# EasyEDA Pro project NI接口485_测试板子_2.eprj

# Schematic Schematic1
Create Date: 2023-08-04; Page Name: 接转接板; Project Name: NI接口485_测试板子_2; Schematic Name: Schematic1; Update Date: 2023-08-17; Company: 嘉立创EDA; Page Size: A4; Version: V1.0
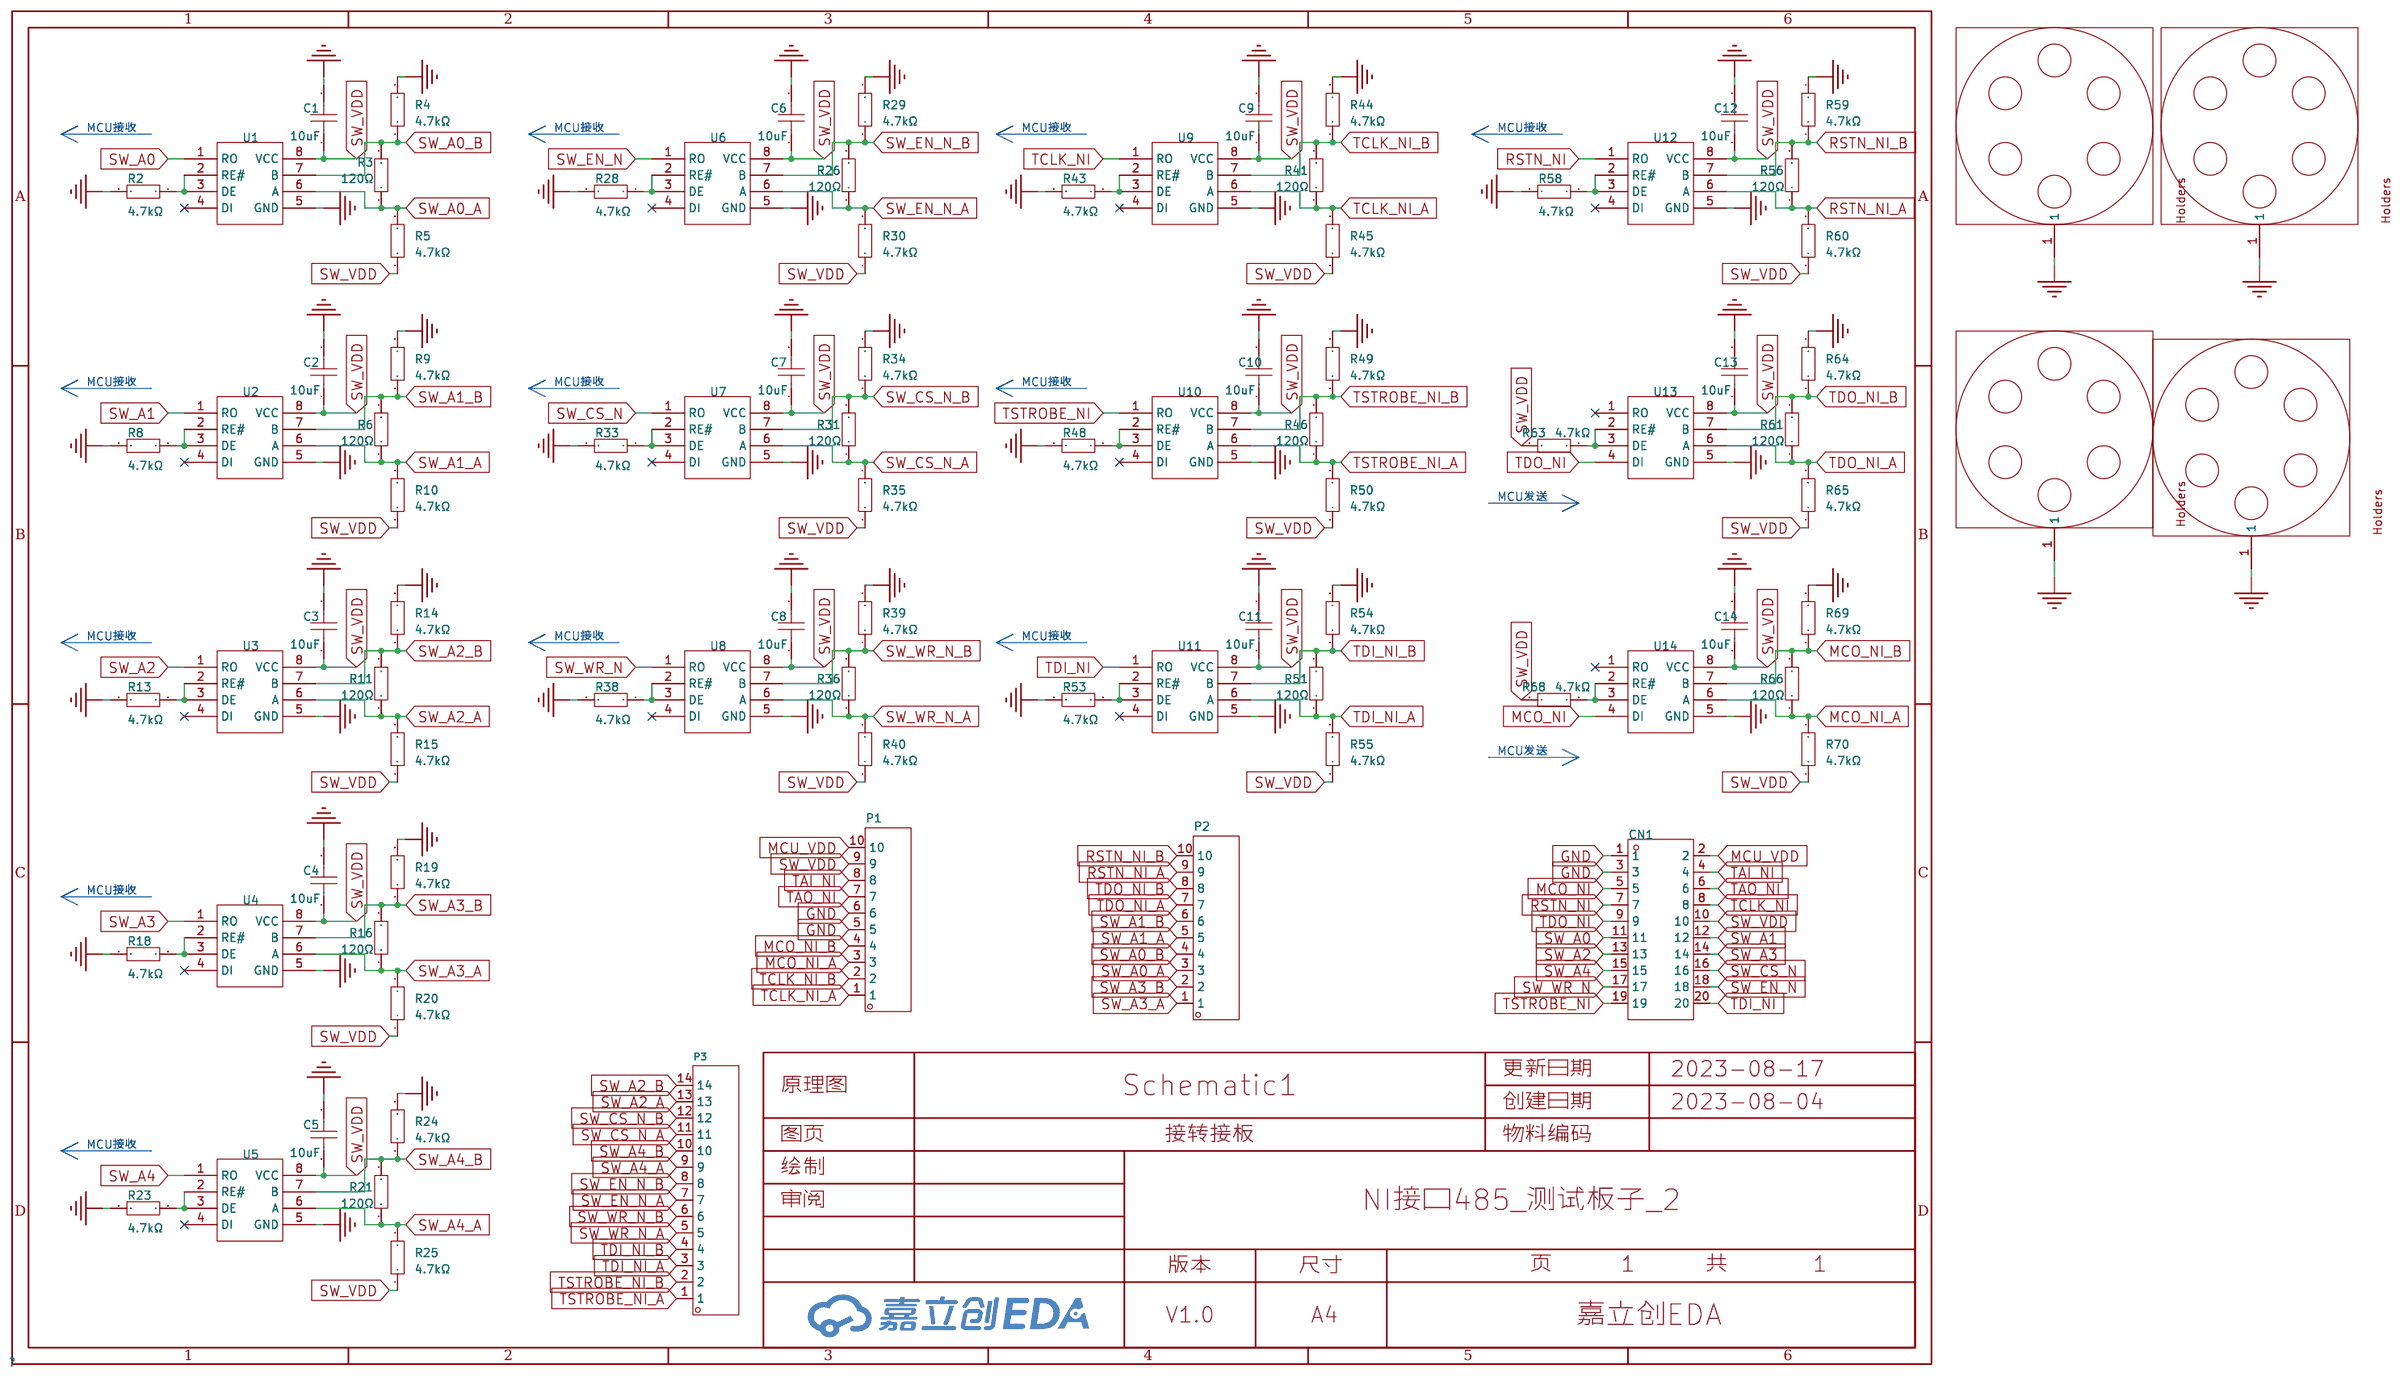
[diagram p0: schematic sheet]

## Parts
C1  10uF  [C0603]
C2  10uF  [C0603]
C3  10uF  [C0603]
C4  10uF  [C0603]
C5  10uF  [C0603]
C6  10uF  [C0603]
C7  10uF  [C0603]
C8  10uF  [C0603]
C9  10uF  [C0603]
C10  10uF  [C0603]
C11  10uF  [C0603]
C12  10uF  [C0603]
C13  10uF  [C0603]
C14  10uF  [C0603]
CN1  BH254V-20P  [CONN-TH_20P-P2.54_0702462001]
J1  -  [DEMO板安装孔]
J2  -  [DEMO板安装孔]
J3  -  [DEMO板安装孔]
J4  -  [DEMO板安装孔]
P1  WJ15EDGRC-3.81-10P  [CONN-TH_10P-P3.81_WJ15EDGRC-3.81-10P]
P2  WJ15EDGRC-3.81-10P  [CONN-TH_10P-P3.81_WJ15EDGRC-3.81-10P]
P3  WJ15EDGRC-3.81-14P  [CONN-TH_14P-P3.81_WJ15EDGRC-3.81-14P]
R2  4.7kΩ  [R0603]
R3  120Ω  [R0603]
R4  4.7kΩ  [R0603]
R5  4.7kΩ  [R0603]
R6  120Ω  [R0603]
R8  4.7kΩ  [R0603]
R9  4.7kΩ  [R0603]
R10  4.7kΩ  [R0603]
R11  120Ω  [R0603]
R13  4.7kΩ  [R0603]
R14  4.7kΩ  [R0603]
R15  4.7kΩ  [R0603]
R16  120Ω  [R0603]
R18  4.7kΩ  [R0603]
R19  4.7kΩ  [R0603]
R20  4.7kΩ  [R0603]
R21  120Ω  [R0603]
R23  4.7kΩ  [R0603]
R24  4.7kΩ  [R0603]
R25  4.7kΩ  [R0603]
R26  120Ω  [R0603]
R28  4.7kΩ  [R0603]
R29  4.7kΩ  [R0603]
R30  4.7kΩ  [R0603]
R31  120Ω  [R0603]
R33  4.7kΩ  [R0603]
R34  4.7kΩ  [R0603]
R35  4.7kΩ  [R0603]
R36  120Ω  [R0603]
R38  4.7kΩ  [R0603]
R39  4.7kΩ  [R0603]
R40  4.7kΩ  [R0603]
R41  120Ω  [R0603]
R43  4.7kΩ  [R0603]
R44  4.7kΩ  [R0603]
R45  4.7kΩ  [R0603]
R46  120Ω  [R0603]
R48  4.7kΩ  [R0603]
R49  4.7kΩ  [R0603]
R50  4.7kΩ  [R0603]
R51  120Ω  [R0603]
R53  4.7kΩ  [R0603]
R54  4.7kΩ  [R0603]
R55  4.7kΩ  [R0603]
R56  120Ω  [R0603]
R58  4.7kΩ  [R0603]
R59  4.7kΩ  [R0603]
R60  4.7kΩ  [R0603]
R61  120Ω  [R0603]
R63  4.7kΩ  [R0603]
R64  4.7kΩ  [R0603]
R65  4.7kΩ  [R0603]
R66  120Ω  [R0603]
R68  4.7kΩ  [R0603]
R69  4.7kΩ  [R0603]
R70  4.7kΩ  [R0603]
U1  SP485EEN-L/TR  [SOIC-8_L5.0-W4.0-P1.27-LS6.0-BL]
U2  SP485EEN-L/TR  [SOIC-8_L5.0-W4.0-P1.27-LS6.0-BL]
U3  SP485EEN-L/TR  [SOIC-8_L5.0-W4.0-P1.27-LS6.0-BL]
U4  SP485EEN-L/TR  [SOIC-8_L5.0-W4.0-P1.27-LS6.0-BL]
U5  SP485EEN-L/TR  [SOIC-8_L5.0-W4.0-P1.27-LS6.0-BL]
U6  SP485EEN-L/TR  [SOIC-8_L5.0-W4.0-P1.27-LS6.0-BL]
U7  SP485EEN-L/TR  [SOIC-8_L5.0-W4.0-P1.27-LS6.0-BL]
U8  SP485EEN-L/TR  [SOIC-8_L5.0-W4.0-P1.27-LS6.0-BL]
U9  SP485EEN-L/TR  [SOIC-8_L5.0-W4.0-P1.27-LS6.0-BL]
U10  SP485EEN-L/TR  [SOIC-8_L5.0-W4.0-P1.27-LS6.0-BL]
U11  SP485EEN-L/TR  [SOIC-8_L5.0-W4.0-P1.27-LS6.0-BL]
U12  SP485EEN-L/TR  [SOIC-8_L5.0-W4.0-P1.27-LS6.0-BL]
U13  SP485EEN-L/TR  [SOIC-8_L5.0-W4.0-P1.27-LS6.0-BL]
U14  SP485EEN-L/TR  [SOIC-8_L5.0-W4.0-P1.27-LS6.0-BL]

## Library data of the parts
C1-C14 = CL10A106KP8NNNC: 容值:10uF;精度:±10%;额定电压:10V;材质(温度系数):X5R;; LCSC Part Name: 10uF ±10% 10V; Supplier Part: C19702; Manufacturer: SAMSUNG(三星); Supplier Footprint: 0603; JLCPCB Part Class: Basic Part; Datasheet: https://atta.szlcsc.com/upload/public/pdf/source/20160103/1457707703378.pdf; Supplier: LCSC; Tolerance: ±10%; Voltage Rated: 10V; Temperature Coefficient: X5R
CN1 = BH254V-20P: 连接器类型:简牛座;每排PIN数:10;结构:2x10P;排数:2;间距:2.54mm;行距:2.54mm;封装形式:直插;额定电流:3A;额定电压:250V;工作温度范围:-40℃~+105℃;; LCSC Part Name: 每排P数:10 2x10P 排数:2 2.54mm; Supplier Part: C492444; Manufacturer: XFCN(兴飞); Supplier Footprint: 插件,P=2.54mm; JLCPCB Part Class: Extended Part; Datasheet: https://atta.szlcsc.com/upload/public/pdf/source/20200312/C492444_4AABE2FC4F6BE8226B85135616AF0092.pdf; Supplier: LCSC; Connector Type: 简牛座; Pin Number in each Row: 10; Structure: 2x10P; Number of Rows: 2; Pitch: 2.54mm; Row Spacing: 2.54mm; Holder Type: 直插; Current Rating (Max): 3A; Voltage Rating (Max): 250V; Operating Temperature Range: -40℃~+105℃
J1-J4 = 螺孔_3.1X6MM
P1 P2 = WJ15EDGRC-3.81-10P: 连接器类型:板端/插座-闭口;间距:3.81mm;排数:1;每排PIN数:10;安装方式:弯针;颜色:绿色;; LCSC Part Name: 板端/插座-闭口 3.81mm 排数:1 每排P数:10 弯针; Supplier Part: C26895; Manufacturer: KANGNEX(康奈克斯电气); Supplier Footprint: P=3.81mm; JLCPCB Part Class: Extended Part; Datasheet: https://atta.szlcsc.com/upload/public/pdf/source/20191225/C26895_4D916DB43CEF69A0001F97FDF773E4BF.pdf; Supplier: LCSC; Connector Type: 板端/插座-闭口; Pitch: 3.81mm; Number of Rows: 1; Number of PINs Per Row: 10; Mounting Style: 弯针; Color: 绿色
P3 = WJ15EDGRC-3.81-14P: 连接器类型:板端/插座-闭口;结构:1x14P;间距:3.81mm;排数:1;每排PIN数:14;安装方式:弯针;颜色:绿色;; LCSC Part Name: 板端/插座-闭口 1x14P 3.81mm 排数:1 每排P数:14 弯针; Supplier Part: C31933; Manufacturer: KANGNEX(康奈克斯电气); Supplier Footprint: 弯插,P=3.81mm; JLCPCB Part Class: Extended Part; Datasheet: https://atta.szlcsc.com/upload/public/pdf/source/20191225/C31933_D56DE114D60976BC410F77D80AC71242.pdf; Supplier: LCSC; Connector Type: 板端/插座-闭口; Structure: 1x14P; Pitch: 3.81mm; Number of Rows: 1; Number of PINs Per Row: 14; Mounting Style: 弯针; Color: 绿色
R2 R4 R5 R8-R10 R13-R15 R18-R20 R23-R25 R28-R30 R33-R35 R38-R40 R43-R45 R48-R50 R53-R55 R58-R60 R63-R65 R68-R70 = 0603WAF4701T5E: 电阻类型:厚膜电阻;阻值:4.7kΩ;精度:±1%;功率:100mW;; LCSC Part Name: 4.7kΩ ±1% 100mW; Supplier Part: C23162; Manufacturer: UNI-ROYAL(厚声); Supplier Footprint: 0603; JLCPCB Part Class: Basic Part; Datasheet: https://atta.szlcsc.com/upload/public/pdf/source/20200306/C422600_1E6D84923E4A46A82E41ADD87F860B5C.pdf; Supplier: LCSC; Type: 厚膜电阻; Tolerance: ±1%; Power(Watts): 100mW; Temperature Coefficient: ±100ppm/℃; Overload Voltage (Max): 75V; Operating Temperature Range: -55℃~+155℃
R3 R6 R11 R16 R21 R26 R31 R36 R41 R46 R51 R56 R61 R66 = 0603WAF1200T5E: 电阻类型:厚膜电阻;阻值:120Ω;精度:±1%;功率:100mW;; LCSC Part Name: 120Ω ±1% 100mW; Supplier Part: C22787; Manufacturer: UNI-ROYAL(厚声); Supplier Footprint: 0603; JLCPCB Part Class: Basic Part; Datasheet: https://atta.szlcsc.com/upload/public/pdf/source/20200306/C422600_1E6D84923E4A46A82E41ADD87F860B5C.pdf; Supplier: LCSC; Type: 厚膜电阻; Tolerance: ±1%; Power(Watts): 100mW; Temperature Coefficient: ±100ppm/℃; Overload Voltage (Max): 75V; Operating Temperature Range: -55℃~+155℃
U1-U14 = SP485EEN-L/TR: 类型:收发器;驱动器/接收器:1/1;数据速率:10Mbps;; LCSC Part Name: 5V供电 10Mbps 收发器; Supplier Part: C6855; Manufacturer: MaxLinear; Supplier Footprint: SOIC-8; JLCPCB Part Class: Basic Part; Datasheet: https://atta.szlcsc.com/upload/public/pdf/source/20210125/C916163_66C97B5ACCC910994E8B10780F9BD300.pdf; Supplier: LCSC; Types: 收发器; Driver/receiver: 1/1; Data Rate: 10Mbps; Supply Voltage: 4.75V~5.25V

## Nets
GND: C1.2 C2.2 C3.2 C4.2 C5.2 C6.2 C7.2 C8.2 C9.2 C10.2 C11.2 C12.2 C13.2 C14.2 CN1.1 CN1.3 J1.1 J2.1 J3.1 J4.1 P1.5 P1.6 R2.2 R4.2 R8.2 R9.2 R13.2 R14.2 R18.2 R19.2 R23.2 R24.2 R28.2 R29.2 R33.2 R34.2 R38.2 R39.2 R43.2 R44.2 R48.2 R49.2 R53.2 R54.2 R58.2 R59.2 R64.2 R69.2 U1.5(GND) U2.5(GND) U3.5(GND) U4.5(GND) U5.5(GND) U6.5(GND) U7.5(GND) U8.5(GND) U9.5(GND) U10.5(GND) U11.5(GND) U12.5(GND) U13.5(GND) U14.5(GND)
MCO_NI: CN1.5 U14.4(DI)
MCO_NI_A: P1.3 R66.1 R70.2 U14.6(A)
MCO_NI_B: P1.4 R66.2 R69.1 U14.7(B)
MCU_VDD: CN1.2 P1.10
RSTN_NI: CN1.7 U12.1(RO)
RSTN_NI_A: P2.9 R56.1 R60.2 U12.6(A)
RSTN_NI_B: P2.10 R56.2 R59.1 U12.7(B)
SW_A0: CN1.11 U1.1(RO)
SW_A0_A: P2.3 R3.1 R5.2 U1.6(A)
SW_A0_B: P2.4 R3.2 R4.1 U1.7(B)
SW_A1: CN1.12 U2.1(RO)
SW_A1_A: P2.5 R6.1 R10.2 U2.6(A)
SW_A1_B: P2.6 R6.2 R9.1 U2.7(B)
SW_A2: CN1.13 U3.1(RO)
SW_A2_A: P3.13 R11.1 R15.2 U3.6(A)
SW_A2_B: P3.14 R11.2 R14.1 U3.7(B)
SW_A3: CN1.14 U4.1(RO)
SW_A3_A: P2.1 R16.1 R20.2 U4.6(A)
SW_A3_B: P2.2 R16.2 R19.1 U4.7(B)
SW_A4: CN1.15 U5.1(RO)
SW_A4_A: P3.9 R21.1 R25.2 U5.6(A)
SW_A4_B: P3.10 R21.2 R24.1 U5.7(B)
SW_CS_N: CN1.16 U7.1(RO)
SW_CS_N_A: P3.11 R31.1 R35.2 U7.6(A)
SW_CS_N_B: P3.12 R31.2 R34.1 U7.7(B)
SW_EN_N: CN1.18 U6.1(RO)
SW_EN_N_A: P3.7 R26.1 R30.2 U6.6(A)
SW_EN_N_B: P3.8 R26.2 R29.1 U6.7(B)
SW_VDD: C1.1 C2.1 C3.1 C4.1 C5.1 C6.1 C7.1 C8.1 C9.1 C10.1 C11.1 C12.1 C13.1 C14.1 CN1.10 P1.9 R5.1 R10.1 R15.1 R20.1 R25.1 R30.1 R35.1 R40.1 R45.1 R50.1 R55.1 R60.1 R63.2 R65.1 R68.2 R70.1 U1.8(VCC) U2.8(VCC) U3.8(VCC) U4.8(VCC) U5.8(VCC) U6.8(VCC) U7.8(VCC) U8.8(VCC) U9.8(VCC) U10.8(VCC) U11.8(VCC) U12.8(VCC) U13.8(VCC) U14.8(VCC)
SW_WR_N: CN1.17 U8.1(RO)
SW_WR_N_A: P3.5 R36.1 R40.2 U8.6(A)
SW_WR_N_B: P3.6 R36.2 R39.1 U8.7(B)
TAI_NI: CN1.4 P1.8
TAO_NI: CN1.6 P1.7
TCLK_NI: CN1.8 U9.1(RO)
TCLK_NI_A: P1.1 R41.1 R45.2 U9.6(A)
TCLK_NI_B: P1.2 R41.2 R44.1 U9.7(B)
TDI_NI: CN1.20 U11.1(RO)
TDI_NI_A: P3.3 R51.1 R55.2 U11.6(A)
TDI_NI_B: P3.4 R51.2 R54.1 U11.7(B)
TDO_NI: CN1.9 U13.4(DI)
TDO_NI_A: P2.7 R61.1 R65.2 U13.6(A)
TDO_NI_B: P2.8 R61.2 R64.1 U13.7(B)
TSTROBE_NI: CN1.19 U10.1(RO)
TSTROBE_NI_A: P3.1 R46.1 R50.2 U10.6(A)
TSTROBE_NI_B: P3.2 R46.2 R49.1 U10.7(B)
$1N832: R2.1 U1.2(RE#) U1.3(DE)
$1N23092: R8.1 U2.2(RE#) U2.3(DE)
$1N23454: R13.1 U3.2(RE#) U3.3(DE)
$1N23823: R18.1 U4.2(RE#) U4.3(DE)
$1N24177: R23.1 U5.2(RE#) U5.3(DE)
$1N24547: R28.1 U6.2(RE#) U6.3(DE)
$1N24901: R33.1 U7.2(RE#) U7.3(DE)
$1N25255: R38.1 U8.2(RE#) U8.3(DE)
$1N26283: R43.1 U9.2(RE#) U9.3(DE)
$1N26304: R48.1 U10.2(RE#) U10.3(DE)
$1N26325: R53.1 U11.2(RE#) U11.3(DE)
$1N27345: R58.1 U12.2(RE#) U12.3(DE)
$1N27366: R63.1 U13.2(RE#) U13.3(DE)
$1N27387: R68.1 U14.2(RE#) U14.3(DE)

Not connected (* = marked no-connect by the designer): U1 4(DI)*; U2 4(DI)*; U3 4(DI)*; U4 4(DI)*; U5 4(DI)*; U6 4(DI)*; U7 4(DI)*; U8 4(DI)*; U9 4(DI)*; U10 4(DI)*; U11 4(DI)*; U12 4(DI)*; U13 1(RO)*; U14 1(RO)*

## Notes on the sheet
- MCU接收
- MCU接收
- MCU接收
- MCU接收
- MCU接收
- MCU接收
- MCU接收
- MCU发送
- MCU接收
- MCU接收
- MCU接收
- MCU发送
- MCU接收
- MCU接收

# Schematic Schematic2
Create Date: 2023-08-04; Page Name: 接NI; Project Name: NI接口485_测试板子_2; Schematic Name: Schematic2; Update Date: 2023-08-21; Company: 嘉立创EDA; Page Size: A4; Version: V1.0
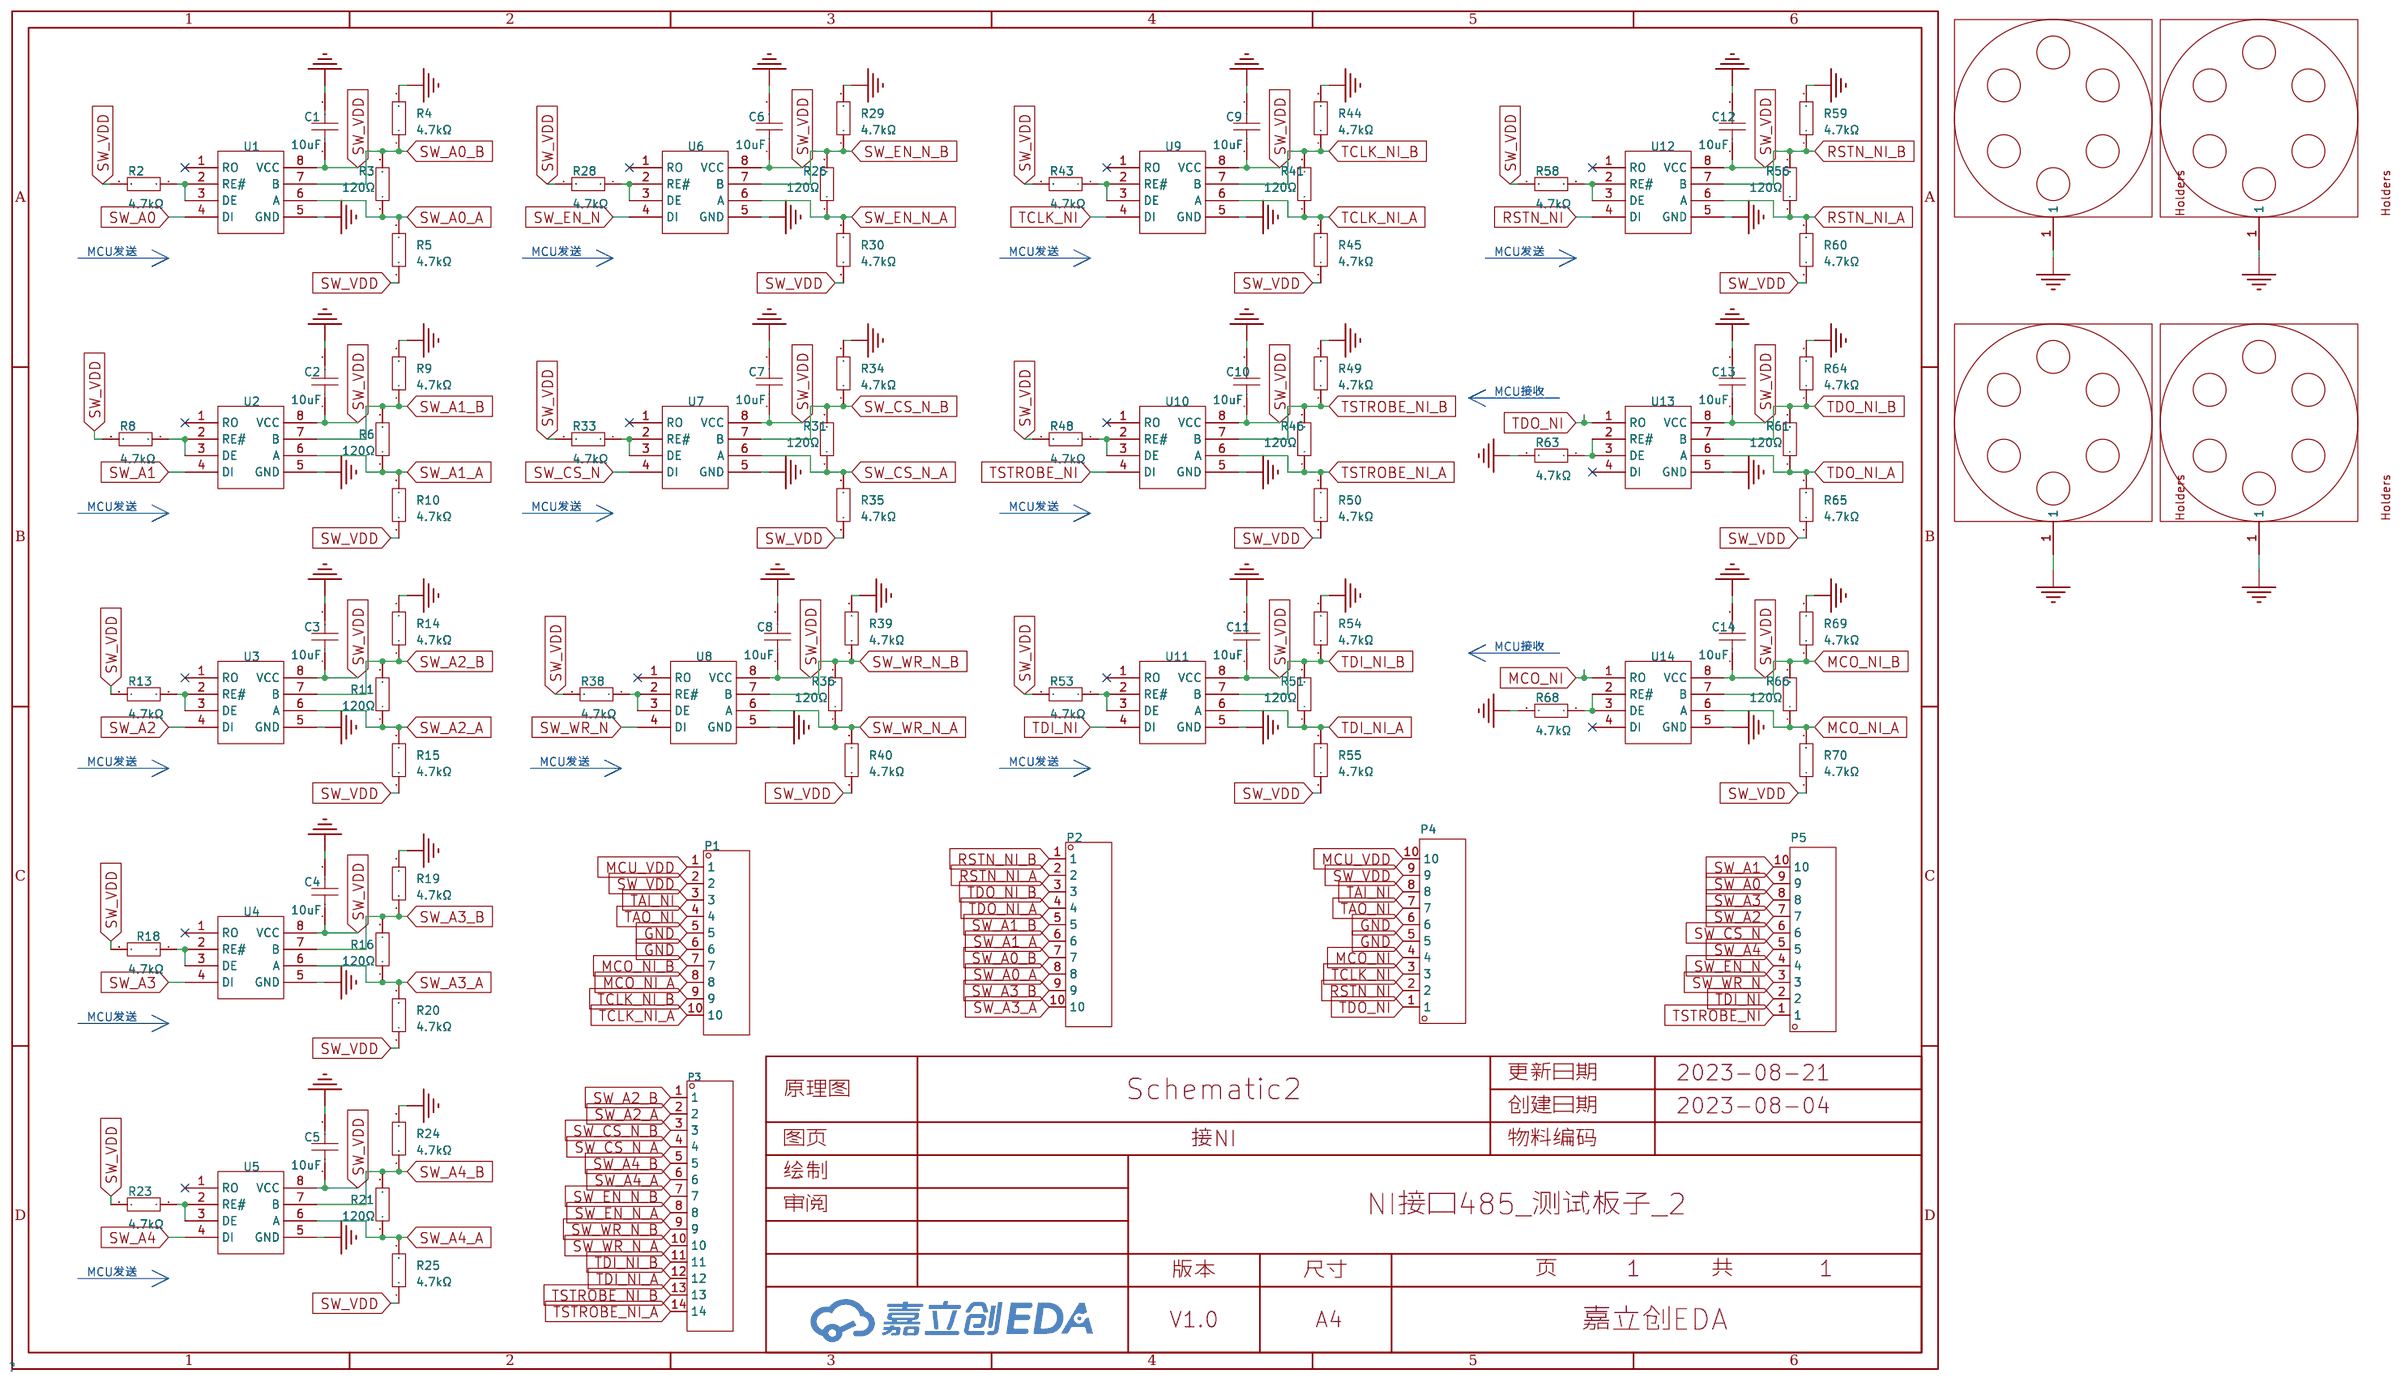
[diagram p1: schematic sheet]

## Parts
C1  10uF  [C0603]
C2  10uF  [C0603]
C3  10uF  [C0603]
C4  10uF  [C0603]
C5  10uF  [C0603]
C6  10uF  [C0603]
C7  10uF  [C0603]
C8  10uF  [C0603]
C9  10uF  [C0603]
C10  10uF  [C0603]
C11  10uF  [C0603]
C12  10uF  [C0603]
C13  10uF  [C0603]
C14  10uF  [C0603]
J1  -  [DEMO板安装孔]
J2  -  [DEMO板安装孔]
J3  -  [DEMO板安装孔]
J4  -  [DEMO板安装孔]
P1  WJ15EDGRC-3.81-10P  [CONN-TH_10P-P3.81_WJ15EDGRC-3.81-10P]
P2  WJ15EDGRC-3.81-10P  [CONN-TH_10P-P3.81_WJ15EDGRC-3.81-10P]
P3  WJ15EDGRC-3.81-14P  [CONN-TH_14P-P3.81_WJ15EDGRC-3.81-14P]
P4  WJ15EDGRC-3.81-10P  [CONN-TH_10P-P3.81_WJ15EDGRC-3.81-10P]
P5  WJ15EDGRC-3.81-10P  [CONN-TH_10P-P3.81_WJ15EDGRC-3.81-10P]
R2  4.7kΩ  [R0603]
R3  120Ω  [R0603]
R4  4.7kΩ  [R0603]
R5  4.7kΩ  [R0603]
R6  120Ω  [R0603]
R8  4.7kΩ  [R0603]
R9  4.7kΩ  [R0603]
R10  4.7kΩ  [R0603]
R11  120Ω  [R0603]
R13  4.7kΩ  [R0603]
R14  4.7kΩ  [R0603]
R15  4.7kΩ  [R0603]
R16  120Ω  [R0603]
R18  4.7kΩ  [R0603]
R19  4.7kΩ  [R0603]
R20  4.7kΩ  [R0603]
R21  120Ω  [R0603]
R23  4.7kΩ  [R0603]
R24  4.7kΩ  [R0603]
R25  4.7kΩ  [R0603]
R26  120Ω  [R0603]
R28  4.7kΩ  [R0603]
R29  4.7kΩ  [R0603]
R30  4.7kΩ  [R0603]
R31  120Ω  [R0603]
R33  4.7kΩ  [R0603]
R34  4.7kΩ  [R0603]
R35  4.7kΩ  [R0603]
R36  120Ω  [R0603]
R38  4.7kΩ  [R0603]
R39  4.7kΩ  [R0603]
R40  4.7kΩ  [R0603]
R41  120Ω  [R0603]
R43  4.7kΩ  [R0603]
R44  4.7kΩ  [R0603]
R45  4.7kΩ  [R0603]
R46  120Ω  [R0603]
R48  4.7kΩ  [R0603]
R49  4.7kΩ  [R0603]
R50  4.7kΩ  [R0603]
R51  120Ω  [R0603]
R53  4.7kΩ  [R0603]
R54  4.7kΩ  [R0603]
R55  4.7kΩ  [R0603]
R56  120Ω  [R0603]
R58  4.7kΩ  [R0603]
R59  4.7kΩ  [R0603]
R60  4.7kΩ  [R0603]
R61  120Ω  [R0603]
R63  4.7kΩ  [R0603]
R64  4.7kΩ  [R0603]
R65  4.7kΩ  [R0603]
R66  120Ω  [R0603]
R68  4.7kΩ  [R0603]
R69  4.7kΩ  [R0603]
R70  4.7kΩ  [R0603]
U1  SP485EEN-L/TR  [SOIC-8_L5.0-W4.0-P1.27-LS6.0-BL]
U2  SP485EEN-L/TR  [SOIC-8_L5.0-W4.0-P1.27-LS6.0-BL]
U3  SP485EEN-L/TR  [SOIC-8_L5.0-W4.0-P1.27-LS6.0-BL]
U4  SP485EEN-L/TR  [SOIC-8_L5.0-W4.0-P1.27-LS6.0-BL]
U5  SP485EEN-L/TR  [SOIC-8_L5.0-W4.0-P1.27-LS6.0-BL]
U6  SP485EEN-L/TR  [SOIC-8_L5.0-W4.0-P1.27-LS6.0-BL]
U7  SP485EEN-L/TR  [SOIC-8_L5.0-W4.0-P1.27-LS6.0-BL]
U8  SP485EEN-L/TR  [SOIC-8_L5.0-W4.0-P1.27-LS6.0-BL]
U9  SP485EEN-L/TR  [SOIC-8_L5.0-W4.0-P1.27-LS6.0-BL]
U10  SP485EEN-L/TR  [SOIC-8_L5.0-W4.0-P1.27-LS6.0-BL]
U11  SP485EEN-L/TR  [SOIC-8_L5.0-W4.0-P1.27-LS6.0-BL]
U12  SP485EEN-L/TR  [SOIC-8_L5.0-W4.0-P1.27-LS6.0-BL]
U13  SP485EEN-L/TR  [SOIC-8_L5.0-W4.0-P1.27-LS6.0-BL]
U14  SP485EEN-L/TR  [SOIC-8_L5.0-W4.0-P1.27-LS6.0-BL]

## Library data of the parts
C1-C14 = CL10A106KP8NNNC: 容值:10uF;精度:±10%;额定电压:10V;材质(温度系数):X5R;; LCSC Part Name: 10uF ±10% 10V; Supplier Part: C19702; Manufacturer: SAMSUNG(三星); Supplier Footprint: 0603; JLCPCB Part Class: Basic Part; Datasheet: https://atta.szlcsc.com/upload/public/pdf/source/20160103/1457707703378.pdf; Supplier: LCSC; Tolerance: ±10%; Voltage Rated: 10V; Temperature Coefficient: X5R
J1-J4 = 螺孔_3.1X6MM
P1 P2 P4 P5 = WJ15EDGRC-3.81-10P: 连接器类型:板端/插座-闭口;间距:3.81mm;排数:1;每排PIN数:10;安装方式:弯针;颜色:绿色;; LCSC Part Name: 板端/插座-闭口 3.81mm 排数:1 每排P数:10 弯针; Supplier Part: C26895; Manufacturer: KANGNEX(康奈克斯电气); Supplier Footprint: P=3.81mm; JLCPCB Part Class: Extended Part; Datasheet: https://atta.szlcsc.com/upload/public/pdf/source/20191225/C26895_4D916DB43CEF69A0001F97FDF773E4BF.pdf; Supplier: LCSC; Connector Type: 板端/插座-闭口; Pitch: 3.81mm; Number of Rows: 1; Number of PINs Per Row: 10; Mounting Style: 弯针; Color: 绿色
P3 = WJ15EDGRC-3.81-14P: 连接器类型:板端/插座-闭口;结构:1x14P;间距:3.81mm;排数:1;每排PIN数:14;安装方式:弯针;颜色:绿色;; LCSC Part Name: 板端/插座-闭口 1x14P 3.81mm 排数:1 每排P数:14 弯针; Supplier Part: C31933; Manufacturer: KANGNEX(康奈克斯电气); Supplier Footprint: 弯插,P=3.81mm; JLCPCB Part Class: Extended Part; Datasheet: https://atta.szlcsc.com/upload/public/pdf/source/20191225/C31933_D56DE114D60976BC410F77D80AC71242.pdf; Supplier: LCSC; Connector Type: 板端/插座-闭口; Structure: 1x14P; Pitch: 3.81mm; Number of Rows: 1; Number of PINs Per Row: 14; Mounting Style: 弯针; Color: 绿色
R2 R4 R5 R8-R10 R13-R15 R18-R20 R23-R25 R28-R30 R33-R35 R38-R40 R43-R45 R48-R50 R53-R55 R58-R60 R63-R65 R68-R70 = 0603WAF4701T5E: 电阻类型:厚膜电阻;阻值:4.7kΩ;精度:±1%;功率:100mW;; LCSC Part Name: 4.7kΩ ±1% 100mW; Supplier Part: C23162; Manufacturer: UNI-ROYAL(厚声); Supplier Footprint: 0603; JLCPCB Part Class: Basic Part; Datasheet: https://atta.szlcsc.com/upload/public/pdf/source/20200306/C422600_1E6D84923E4A46A82E41ADD87F860B5C.pdf; Supplier: LCSC; Type: 厚膜电阻; Tolerance: ±1%; Power(Watts): 100mW; Temperature Coefficient: ±100ppm/℃; Overload Voltage (Max): 75V; Operating Temperature Range: -55℃~+155℃
R3 R6 R11 R16 R21 R26 R31 R36 R41 R46 R51 R56 R61 R66 = 0603WAF1200T5E: 电阻类型:厚膜电阻;阻值:120Ω;精度:±1%;功率:100mW;; LCSC Part Name: 120Ω ±1% 100mW; Supplier Part: C22787; Manufacturer: UNI-ROYAL(厚声); Supplier Footprint: 0603; JLCPCB Part Class: Basic Part; Datasheet: https://atta.szlcsc.com/upload/public/pdf/source/20200306/C422600_1E6D84923E4A46A82E41ADD87F860B5C.pdf; Supplier: LCSC; Type: 厚膜电阻; Tolerance: ±1%; Power(Watts): 100mW; Temperature Coefficient: ±100ppm/℃; Overload Voltage (Max): 75V; Operating Temperature Range: -55℃~+155℃
U1-U14 = SP485EEN-L/TR: 类型:收发器;驱动器/接收器:1/1;数据速率:10Mbps;; LCSC Part Name: 5V供电 10Mbps 收发器; Supplier Part: C6855; Manufacturer: MaxLinear; Supplier Footprint: SOIC-8; JLCPCB Part Class: Basic Part; Datasheet: https://atta.szlcsc.com/upload/public/pdf/source/20210125/C916163_66C97B5ACCC910994E8B10780F9BD300.pdf; Supplier: LCSC; Types: 收发器; Driver/receiver: 1/1; Data Rate: 10Mbps; Supply Voltage: 4.75V~5.25V

## Nets
GND: C1.2 C2.2 C3.2 C4.2 C5.2 C6.2 C7.2 C8.2 C9.2 C10.2 C11.2 C12.2 C13.2 C14.2 J1.1 J2.1 J3.1 J4.1 P1.5 P1.6 P4.5 P4.6 R4.2 R9.2 R14.2 R19.2 R24.2 R29.2 R34.2 R39.2 R44.2 R49.2 R54.2 R59.2 R63.2 R64.2 R68.2 R69.2 U1.5(GND) U2.5(GND) U3.5(GND) U4.5(GND) U5.5(GND) U6.5(GND) U7.5(GND) U8.5(GND) U9.5(GND) U10.5(GND) U11.5(GND) U12.5(GND) U13.5(GND) U14.5(GND)
MCO_NI: P4.4 U14.1(RO)
MCO_NI_A: P1.8 R66.1 R70.2 U14.6(A)
MCO_NI_B: P1.7 R66.2 R69.1 U14.7(B)
MCU_VDD: P1.1 P4.10
RSTN_NI: P4.2 U12.4(DI)
RSTN_NI_A: P2.2 R56.1 R60.2 U12.6(A)
RSTN_NI_B: P2.1 R56.2 R59.1 U12.7(B)
SW_A0: P5.9 U1.4(DI)
SW_A0_A: P2.8 R3.1 R5.2 U1.6(A)
SW_A0_B: P2.7 R3.2 R4.1 U1.7(B)
SW_A1: P5.10 U2.4(DI)
SW_A1_A: P2.6 R6.1 R10.2 U2.6(A)
SW_A1_B: P2.5 R6.2 R9.1 U2.7(B)
SW_A2: P5.7 U3.4(DI)
SW_A2_A: P3.2 R11.1 R15.2 U3.6(A)
SW_A2_B: P3.1 R11.2 R14.1 U3.7(B)
SW_A3: P5.8 U4.4(DI)
SW_A3_A: P2.10 R16.1 R20.2 U4.6(A)
SW_A3_B: P2.9 R16.2 R19.1 U4.7(B)
SW_A4: P5.5 U5.4(DI)
SW_A4_A: P3.6 R21.1 R25.2 U5.6(A)
SW_A4_B: P3.5 R21.2 R24.1 U5.7(B)
SW_CS_N: P5.6 U7.4(DI)
SW_CS_N_A: P3.4 R31.1 R35.2 U7.6(A)
SW_CS_N_B: P3.3 R31.2 R34.1 U7.7(B)
SW_EN_N: P5.4 U6.4(DI)
SW_EN_N_A: P3.8 R26.1 R30.2 U6.6(A)
SW_EN_N_B: P3.7 R26.2 R29.1 U6.7(B)
SW_VDD: C1.1 C2.1 C3.1 C4.1 C5.1 C6.1 C7.1 C8.1 C9.1 C10.1 C11.1 C12.1 C13.1 C14.1 P1.2 P4.9 R2.2 R5.1 R8.2 R10.1 R13.2 R15.1 R18.2 R20.1 R23.2 R25.1 R28.2 R30.1 R33.2 R35.1 R38.2 R40.1 R43.2 R45.1 R48.2 R50.1 R53.2 R55.1 R58.2 R60.1 R65.1 R70.1 U1.8(VCC) U2.8(VCC) U3.8(VCC) U4.8(VCC) U5.8(VCC) U6.8(VCC) U7.8(VCC) U8.8(VCC) U9.8(VCC) U10.8(VCC) U11.8(VCC) U12.8(VCC) U13.8(VCC) U14.8(VCC)
SW_WR_N: P5.3 U8.4(DI)
SW_WR_N_A: P3.10 R36.1 R40.2 U8.6(A)
SW_WR_N_B: P3.9 R36.2 R39.1 U8.7(B)
TAI_NI: P1.3 P4.8
TAO_NI: P1.4 P4.7
TCLK_NI: P4.3 U9.4(DI)
TCLK_NI_A: P1.10 R41.1 R45.2 U9.6(A)
TCLK_NI_B: P1.9 R41.2 R44.1 U9.7(B)
TDI_NI: P5.2 U11.4(DI)
TDI_NI_A: P3.12 R51.1 R55.2 U11.6(A)
TDI_NI_B: P3.11 R51.2 R54.1 U11.7(B)
TDO_NI: P4.1 U13.1(RO)
TDO_NI_A: P2.4 R61.1 R65.2 U13.6(A)
TDO_NI_B: P2.3 R61.2 R64.1 U13.7(B)
TSTROBE_NI: P5.1 U10.4(DI)
TSTROBE_NI_A: P3.14 R46.1 R50.2 U10.6(A)
TSTROBE_NI_B: P3.13 R46.2 R49.1 U10.7(B)
$1N33003: R2.1 U1.2(RE#) U1.3(DE)
$1N33046: R8.1 U2.2(RE#) U2.3(DE)
$1N33127: R13.1 U3.2(RE#) U3.3(DE)
$1N33159: R18.1 U4.2(RE#) U4.3(DE)
$1N33197: R23.1 U5.2(RE#) U5.3(DE)
$1N33551: R28.1 U6.2(RE#) U6.3(DE)
$1N33913: R33.1 U7.2(RE#) U7.3(DE)
$1N34275: R38.1 U8.2(RE#) U8.3(DE)
$1N34989: R43.1 U9.2(RE#) U9.3(DE)
$1N35351: R48.1 U10.2(RE#) U10.3(DE)
$1N35713: R53.1 U11.2(RE#) U11.3(DE)
$1N36075: R58.1 U12.2(RE#) U12.3(DE)
$1N36432: R63.1 U13.2(RE#) U13.3(DE)
$1N36797: R68.1 U14.2(RE#) U14.3(DE)

Not connected (* = marked no-connect by the designer): U1 1(RO)*; U2 1(RO)*; U3 1(RO)*; U4 1(RO)*; U5 1(RO)*; U6 1(RO)*; U7 1(RO)*; U8 1(RO)*; U9 1(RO)*; U10 1(RO)*; U11 1(RO)*; U12 1(RO)*; U13 4(DI)*; U14 4(DI)*

## Notes on the sheet
- MCU发送
- MCU发送
- MCU发送
- MCU发送
- MCU接收
- MCU发送
- MCU发送
- MCU发送
- MCU接收
- MCU发送
- MCU发送
- MCU发送
- MCU发送
- MCU发送

# Board PCB1
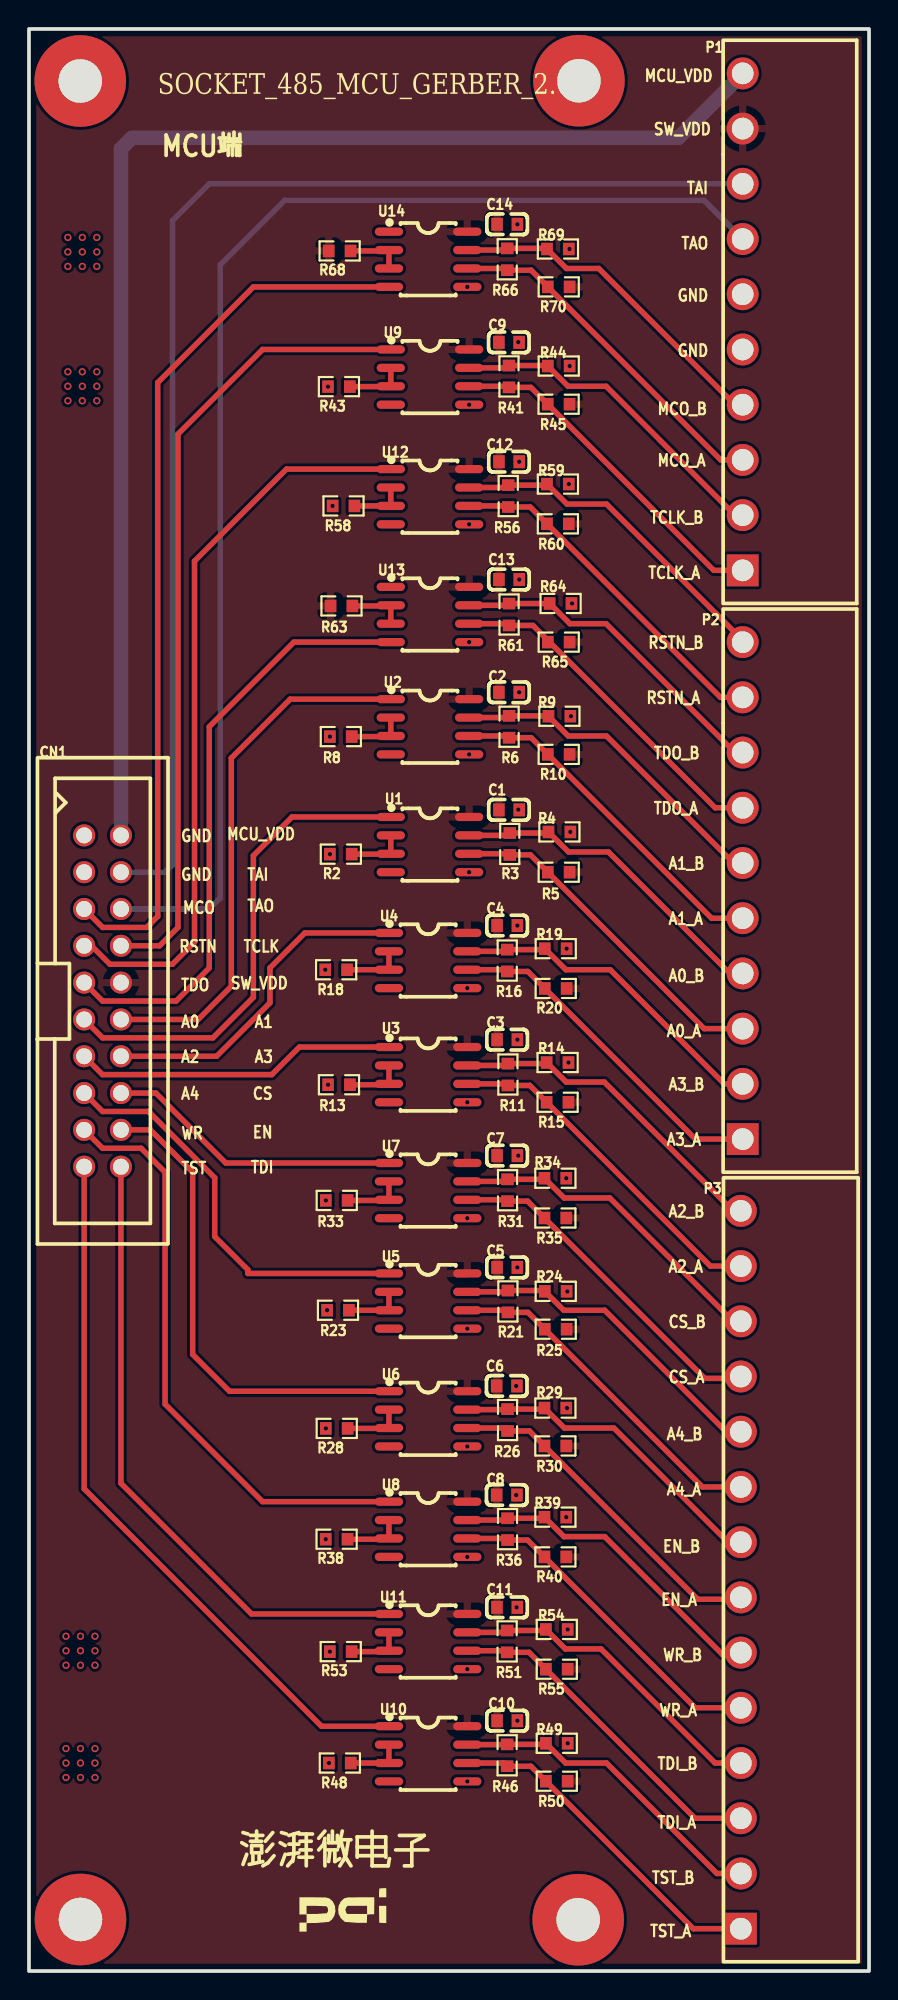
[diagram p2: board, top side]
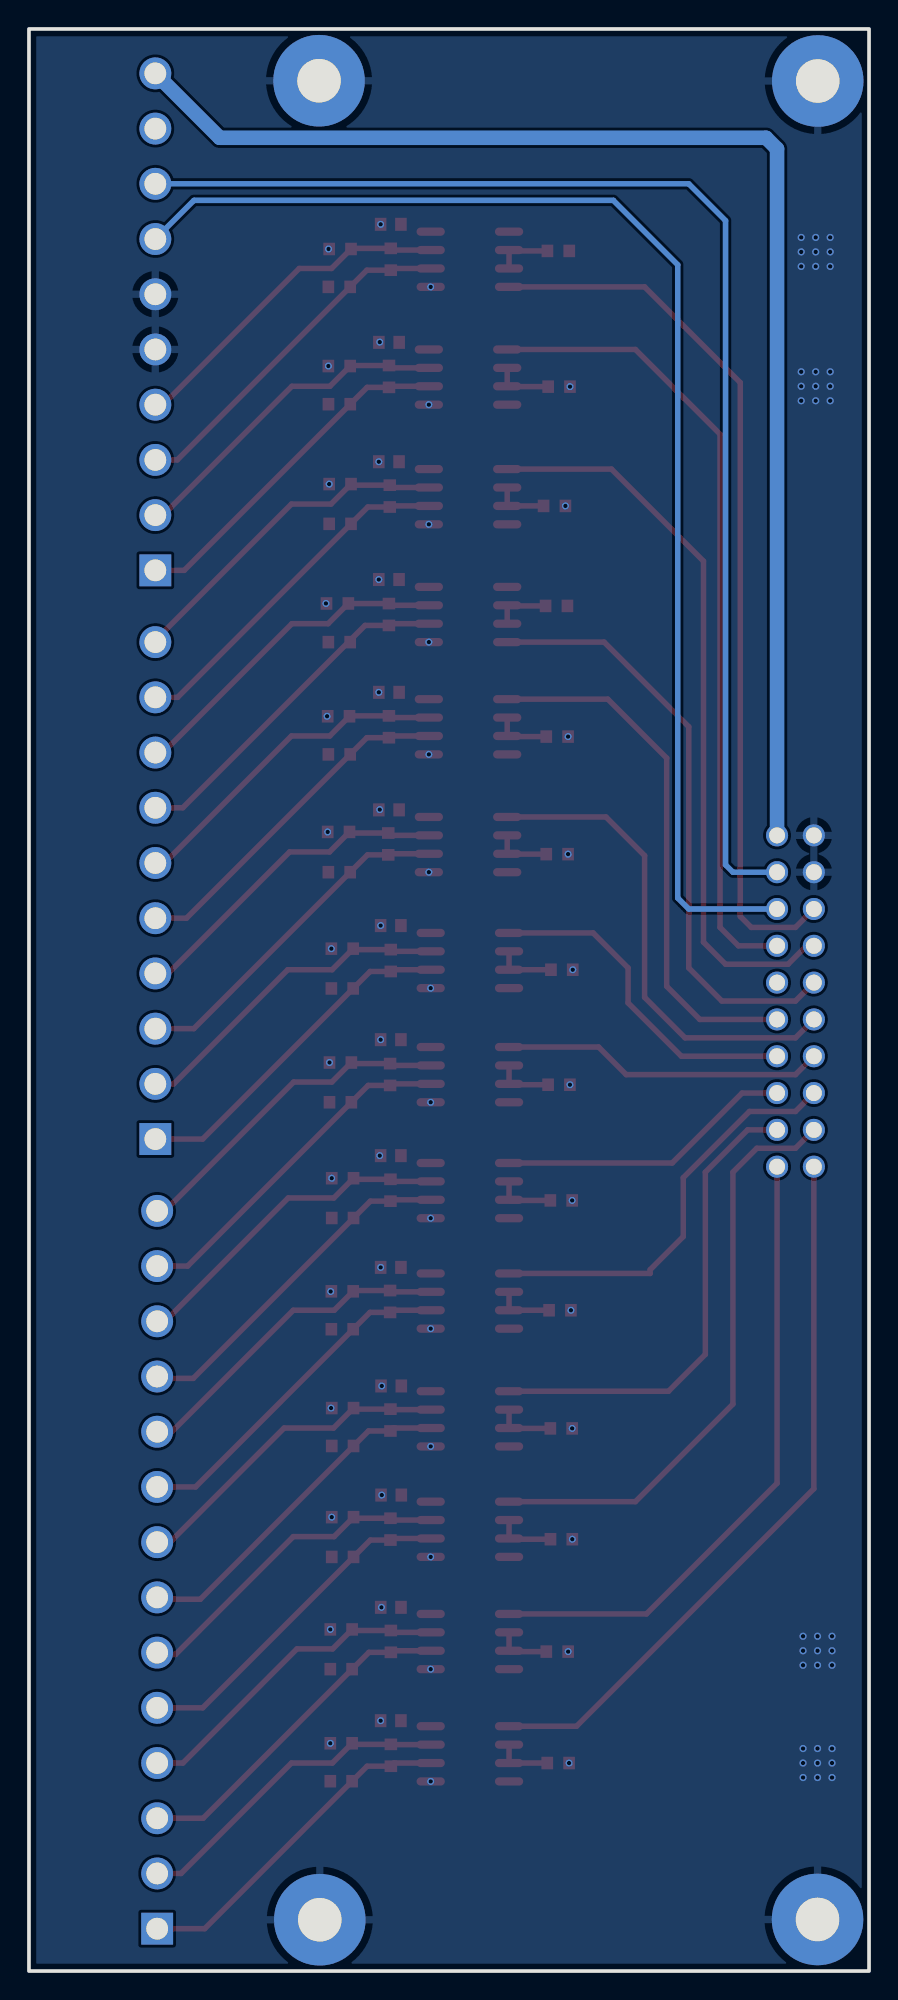
[diagram p3: board, bottom side, seen from below]

Outline 58 x 134 mm; copper layers: Top Layer, Bottom Layer. Coordinates in mm from the lower left corner of the outline.
Outline path: rectangle 0,134 58,0
Stack: Top Layer 0.035mm / Dielectric1 1.51mm FR4 er 4.5 / Bottom Layer 0.035mm

## Design rules (mm)
template: 自定义配置
spacing copperThickness1oz (default): track to track 0.102, other pairs 0.152 to 0.3
spacing copperThickness2oz: track to track 0.203, other pairs 0.152 to 0.3
track width copperThickness1oz (default): min 0.127, default 0.254, max 2.54
track width copperThickness2oz: min 0.203, default 0.254, max 2.54
differential pair differentialPair (default): width min 0.127, default 0.254, max 2.54; gap min 0.152, default 0.152
via viaSize (default): diameter min 0.5, default 0.61, max 10; hole min 0.3, default 0.305, max 6.3

## Placement (name value [footprint] x y rotation side)
C1  10uF  [C0603]  33.15 80.12 0 top
C2  10uF  [C0603]  33.15 88.23 0 top
C3  10uF  [C0603]  33.02 64.26 0 top
C4  10uF  [C0603]  33.02 72.14 0 top
C5  10uF  [C0603]  33.02 48.55 0 top
C6  10uF  [C0603]  32.99 40.37 0 top
C7  10uF  [C0603]  33.02 56.26 0 top
C8  10uF  [C0603]  32.99 32.84 0 top
C9  10uF  [C0603]  33.14 112.38 0 top
C10  10uF  [C0603]  33.02 17.27 0 top
C11  10uF  [C0603]  33.01 25.09 0 top
C12  10uF  [C0603]  33.15 104.14 0 top
C13  10uF  [C0603]  33.15 96.01 0 top
C14  10uF  [C0603]  33.02 120.52 0 top
CN1  BH254V-20P  [CONN-TH_20P-P2.54_0702462001]  5.08 66.93 270 top
J1  -  [demo板安装孔]  3.56 3.56 0 top
J2  -  [demo板安装孔]  37.97 130.43 0 top
J3  -  [demo板安装孔]  3.54 130.41 0 top
J4  -  [demo板安装孔]  37.92 3.54 0 top
P1  WJ15EDGRC-3.81-10P  [CONN-TH_10P-P3.81_WJ15EDGRC-3.81-10P]  49.28 113.79 90 top
P2  WJ15EDGRC-3.81-10P  [CONN-TH_10P-P3.81_WJ15EDGRC-3.81-10P]  49.28 74.55 90 top
P3  WJ15EDGRC-3.81-14P  [CONN-TH_14P-P3.81_WJ15EDGRC-3.81-14P]  49.15 27.69 90 top
R2  4.7kΩ  [R0603]  21.53 77.06 180 top
R3  120Ω  [R0603]  33.19 77.77 90 top
R4  4.7kΩ  [R0603]  36.62 78.59 0 top
R5  4.7kΩ  [R0603]  36.58 75.82 180 top
R6  120Ω  [R0603]  33.15 85.85 90 top
R8  4.7kΩ  [R0603]  21.53 85.17 180 top
R9  4.7kΩ  [R0603]  36.62 86.58 0 top
R10  4.7kΩ  [R0603]  36.58 83.95 180 top
R11  120Ω  [R0603]  33.07 61.86 90 top
R13  4.7kΩ  [R0603]  21.4 61.15 180 top
R14  4.7kΩ  [R0603]  36.5 62.69 0 top
R15  4.7kΩ  [R0603]  36.5 59.94 180 top
R16  120Ω  [R0603]  33.02 69.72 90 top
R18  4.7kΩ  [R0603]  21.21 69.09 180 top
R19  4.7kΩ  [R0603]  36.37 70.54 0 top
R20  4.7kΩ  [R0603]  36.37 67.8 180 top
R21  120Ω  [R0603]  33.07 46.2 90 top
R23  4.7kΩ  [R0603]  21.34 45.59 180 top
R24  4.7kΩ  [R0603]  36.37 46.9 0 top
R25  4.7kΩ  [R0603]  36.37 44.28 180 top
R26  120Ω  [R0603]  33.04 38.02 90 top
R28  4.7kΩ  [R0603]  21.25 37.44 180 top
R29  4.7kΩ  [R0603]  36.34 38.84 0 top
R30  4.7kΩ  [R0603]  36.34 36.23 180 top
R31  120Ω  [R0603]  33.04 53.87 90 top
R33  4.7kΩ  [R0603]  21.25 53.17 180 top
R34  4.7kΩ  [R0603]  36.34 54.7 0 top
R35  4.7kΩ  [R0603]  36.34 51.96 180 top
R36  120Ω  [R0603]  33.04 30.49 90 top
R38  4.7kΩ  [R0603]  21.24 29.79 180 top
R39  4.7kΩ  [R0603]  36.34 31.32 0 top
R40  4.7kΩ  [R0603]  36.34 28.57 180 top
R41  120Ω  [R0603]  33.14 110.03 90 top
R43  4.7kΩ  [R0603]  21.4 109.32 180 top
R44  4.7kΩ  [R0603]  36.58 110.74 0 top
R45  4.7kΩ  [R0603]  36.57 108.11 180 top
R46  120Ω  [R0603]  33.01 14.88 90 top
R48  4.7kΩ  [R0603]  21.46 14.35 180 top
R49  4.7kΩ  [R0603]  36.44 15.71 0 top
R50  4.7kΩ  [R0603]  36.44 13.1 180 top
R51  120Ω  [R0603]  33.01 22.74 90 top
R53  4.7kΩ  [R0603]  21.53 22.04 180 top
R54  4.7kΩ  [R0603]  36.44 23.57 0 top
R55  4.7kΩ  [R0603]  36.44 20.83 180 top
R56  120Ω  [R0603]  33.09 101.77 90 top
R58  4.7kΩ  [R0603]  21.72 101.09 180 top
R59  4.7kΩ  [R0603]  36.52 102.6 0 top
R60  4.7kΩ  [R0603]  36.52 99.86 180 top
R61  120Ω  [R0603]  33.15 93.6 90 top
R63  4.7kΩ  [R0603]  21.58 94.19 180 top
R64  4.7kΩ  [R0603]  36.7 94.36 0 top
R65  4.7kΩ  [R0603]  36.58 91.69 180 top
R66  120Ω  [R0603]  33.02 118.11 90 top
R68  4.7kΩ  [R0603]  21.45 118.69 180 top
R69  4.7kΩ  [R0603]  36.52 118.82 0 top
R70  4.7kΩ  [R0603]  36.58 116.21 180 top
U1  SP485EEN-L/TR  [SOIC-8_L5.0-W4.0-P1.27-LS6.0-BL]  27.69 77.72 270 top
U2  SP485EEN-L/TR  [SOIC-8_L5.0-W4.0-P1.27-LS6.0-BL]  27.69 85.85 270 top
U3  SP485EEN-L/TR  [SOIC-8_L5.0-W4.0-P1.27-LS6.0-BL]  27.56 61.85 270 top
U4  SP485EEN-L/TR  [SOIC-8_L5.0-W4.0-P1.27-LS6.0-BL]  27.56 69.72 270 top
U5  SP485EEN-L/TR  [SOIC-8_L5.0-W4.0-P1.27-LS6.0-BL]  27.56 46.23 270 top
U6  SP485EEN-L/TR  [SOIC-8_L5.0-W4.0-P1.27-LS6.0-BL]  27.56 38.1 270 top
U7  SP485EEN-L/TR  [SOIC-8_L5.0-W4.0-P1.27-LS6.0-BL]  27.56 53.85 270 top
U8  SP485EEN-L/TR  [SOIC-8_L5.0-W4.0-P1.27-LS6.0-BL]  27.56 30.48 270 top
U9  SP485EEN-L/TR  [SOIC-8_L5.0-W4.0-P1.27-LS6.0-BL]  27.69 109.98 270 top
U10  SP485EEN-L/TR  [SOIC-8_L5.0-W4.0-P1.27-LS6.0-BL]  27.56 14.99 270 top
U11  SP485EEN-L/TR  [SOIC-8_L5.0-W4.0-P1.27-LS6.0-BL]  27.56 22.73 270 top
U12  SP485EEN-L/TR  [SOIC-8_L5.0-W4.0-P1.27-LS6.0-BL]  27.69 101.73 270 top
U13  SP485EEN-L/TR  [SOIC-8_L5.0-W4.0-P1.27-LS6.0-BL]  27.69 93.6 270 top
U14  SP485EEN-L/TR  [SOIC-8_L5.0-W4.0-P1.27-LS6.0-BL]  27.56 118.11 270 top

## Footprints (pads in the part's own frame, mm; a bottom-side part is the same pattern mirrored in y, then rotated)
C0603
  rect 0.8x0.9 smd: 1(-0.7,0) 2(0.7,0)
CONN-TH_10P-P3.81_WJ15EDGRC-3.81-10P
  rect 2.2x2.2 hole 1.5: 1(-17.145,0)
  round 2.2 hole 1.5: 2(-13.335,0) 3(-9.525,0) 4(-5.715,0) 5(-1.905,0) 6(1.905,0) 7(5.715,0) 8(9.525,0) 9(13.335,0) 10(17.145,0)
CONN-TH_14P-P3.81_WJ15EDGRC-3.81-14P
  rect 2.2x2.2 hole 1.5: 1(-24.765,0)
  round 2.2 hole 1.5: 2(-20.955,0) 3(-17.145,0) 4(-13.335,0) 5(-9.525,0) 6(-5.715,0) 7(-1.905,0) 8(1.905,0) 9(5.715,0) 10(9.525,0) 11(13.335,0) 12(17.145,0) 13(20.955,0) 14(24.765,0)
CONN-TH_20P-P2.54_0702462001
  round 1.524 hole 1.1: 1(-11.43,-1.27) 2(-11.43,1.27) 3(-8.89,-1.27) 4(-8.89,1.27) 5(-6.35,-1.27) 6(-6.35,1.27) 7(-3.81,-1.27) 8(-3.81,1.27) 9(-1.27,-1.27) 10(-1.27,1.27) 11(1.27,-1.27) 12(1.27,1.27) 13(3.81,-1.27) 14(3.81,1.27) 15(6.35,-1.27) 16(6.35,1.27) 17(8.89,-1.27) 18(8.89,1.27) 19(11.43,-1.27) 20(11.43,1.27)
demo板安装孔
  round 6.32 hole 3: 1(0,0)
R0603
  rect 0.806x0.864 smd: 1(-0.753,0) 2(0.753,0)
SOIC-8_L5.0-W4.0-P1.27-LS6.0-BL
  oval 0.569x1.95 smd: 1(-1.905,-2.705) 2(-0.635,-2.705) 3(0.635,-2.705) 4(1.905,-2.705) 5(1.905,2.705) 6(0.635,2.705) 7(-0.635,2.705) 8(-1.905,2.705)

## Nets
As in the schematic.

Pads without a net: U1 4; U2 4; U3 4; U4 4; U5 4; U6 4; U7 4; U8 4; U9 4; U10 4; U11 4; U12 4; U13 1; U14 1

## Via types
v1: diameter 0.5, hole 0.305, Top Layer to Bottom Layer, 90 vias

## Routing (per net, layer and track width the routed paths; a pad name or vN(x,y) marks a point on that pad's centre or on a via; arc(x,y) is an arc through that point)
GND:
  vias: v1(2.56,23.1) v1(2.56,22.1) v1(2.56,21.1) v1(2.56,15.35) v1(2.56,14.35) v1(2.56,13.35) v1(2.68,119.62) v1(2.68,118.62) v1(2.68,117.62) v1(2.68,110.35) v1(2.68,109.35) v1(2.68,108.35) v1(3.56,23.1) v1(3.56,22.1) v1(3.56,21.1) v1(3.56,15.35) v1(3.56,14.35) v1(3.56,13.35) v1(3.68,119.62) v1(3.68,118.62) v1(3.68,117.62) v1(3.68,110.35) v1(3.68,109.35) v1(3.68,108.35) v1(4.56,23.1) v1(4.56,22.1) v1(4.56,21.1) v1(4.56,15.35) v1(4.56,14.35) v1(4.56,13.35) v1(4.68,119.62) v1(4.68,118.62) v1(4.68,117.62) v1(4.68,110.35) v1(4.68,109.35) v1(4.68,108.35) v1(20.46,69.09) v1(20.5,53.17) v1(20.5,37.44) v1(20.49,29.79) v1(20.65,109.32) v1(20.65,61.15) v1(20.58,45.59) v1(20.77,22.04) v1(20.71,14.35) v1(20.78,85.17) v1(20.78,77.06) v1(20.96,101.09) v1(30.26,116.21) v1(30.26,67.82) v1(30.26,59.94) v1(30.26,51.94) v1(30.26,44.32) v1(30.26,36.19) v1(30.26,28.58) v1(30.26,20.83) v1(30.26,13.08) v1(30.39,108.08) v1(30.39,99.82) v1(30.39,91.69) v1(30.39,83.95) v1(30.39,75.82) v1(33.64,40.37) v1(33.64,32.84) v1(33.66,25.09) v1(33.72,120.52) v1(33.72,72.14) v1(33.72,64.26) v1(33.72,48.55) v1(33.72,17.27) v1(33.78,112.4) v1(33.85,104.14) v1(33.85,96.01) v1(33.84,88.23) v1(33.78,80.14) v1(33.78,56.26) v1(37.12,70.54) v1(37.1,54.7) v1(37.17,46.89) v1(37.14,38.84) v1(37.1,31.32) v1(37.27,102.6) v1(37.25,62.69) v1(37.2,23.57) v1(37.2,15.71) v1(37.32,118.82) v1(37.33,110.74) v1(37.42,86.58) v1(37.38,78.59) v1(37.5,94.36)
MCO_NI: length 61.5
  Top Layer w0.38: U14.4 15.49,116.21 8.89,109.6 8.89,72.77 8.13,72.01 5.08,72.01 3.81,73.28
MCO_NI_A: length 24.5
  Top Layer w0.38: P1.3 47.76,104.27 R70.2 34.67,117.36 R66.1 32.9,117.48 U14.6
MCO_NI_B: length 23.5
  Top Layer w0.38: P1.4 48.74,108.08 39.34,117.48 37.11,117.48 R69.1 35.72,118.86 R66.2 32.9,118.75 U14.7
MCU_VDD: length 92.5
  Bottom Layer w1: CN1.2 6.35,125.73 7.11,126.49 44.83,126.49 P1.10
RSTN_NI: length 51.2
  Top Layer w0.38: U12.1 17.78,103.63 11.43,97.28 11.43,70.99 9.91,69.47 5.59,69.47 4.32,70.74 CN1.7
RSTN_NI_A: length 24.4
  Top Layer w0.38: P2.9 47.74,87.88 R60.2 34.6,101.02 R56.1 33.01,101.09 U12.6
RSTN_NI_B: length 23.6
  Top Layer w0.38: U12.7 32.93,102.36 R56.2 35.69,102.52 R59.1 37.15,101.22 39.88,101.22 49.28,91.82 P2.10
SW_A0: length 33.7
  Top Layer w0.38: CN1.11 5.08,64.39 12.7,64.39 15.49,67.18 15.49,76.96 18.16,79.63 U1.1
SW_A0_A: length 23.9
  Top Layer w0.38: U1.6 33.12,77.09 R3.1 34.63,77.01 R5.2 46.62,65.02 P2.3
SW_A0_B: length 23
  Top Layer w0.38: P2.4 48.39,68.83 40,77.22 37.25,77.22 R4.1 35.8,78.52 R3.2 33.03,78.36 U1.7
SW_A1: length 37
  Top Layer w0.38: CN1.12 11.68,65.66 13.97,67.95 13.97,83.69 18.03,87.76 U2.1
SW_A1_A: length 24.1
  Top Layer w0.38: U2.6 33.03,85.22 R6.1 34.67,85.1 R10.2 47.13,72.64 P2.5
SW_A1_B: length 23.1
  Top Layer w0.38: U2.7 33.03,86.49 R6.2 35.84,86.61 R9.1 37.23,85.22 39.88,85.22 48.64,76.45 P2.6
SW_A2: length 22.4
  Top Layer w0.38: U3.1 18.67,63.75 16.76,61.85 5.08,61.85 CN1.13
SW_A2_A: length 24.1
  Top Layer w0.38: P3.13 47.04,48.64 R15.2 34.58,61.1 R11.1 32.96,61.21 U3.6
SW_A2_B: length 23.2
  Top Layer w0.38: U3.7 32.94,62.48 R11.2 35.67,62.61 R14.1 37.09,61.34 39.72,61.34 48.61,52.45 P3.14
SW_A3: length 23.4
  Top Layer w0.38: U4.1 19.05,71.63 16.64,69.22 16.64,66.8 12.95,63.12 CN1.14
SW_A3_A: length 23.9
  Top Layer w0.38: U4.6 32.9,69.09 R16.1 34.44,68.97 R20.2 46.01,57.4 P2.1
SW_A3_B: length 23
  Top Layer w0.38: P2.2 48.01,61.21 40.13,69.09 37.07,69.09 R19.1 35.55,70.48 R16.2 32.9,70.36 U4.7
SW_A4: length 28.7
  Top Layer w0.38: U5.1 15.11,48.13 15.11,48.39 12.83,50.67 12.83,54.74 8.25,59.31 5.08,59.31 CN1.15
SW_A4_A: length 23.9
  Top Layer w0.38: U5.6 32.92,45.59 R21.1 34.45,45.45 R25.2 46.5,33.4 P3.9
SW_A4_B: length 23
  Top Layer w0.38: P3.10 48.13,37.21 39.75,45.59 36.92,45.59 R24.1 35.56,46.95 R21.2 32.98,46.86 U5.7
SW_CS_N: length 20.5
  Top Layer w0.38: CN1.16 8.76,60.58 13.59,55.75 U7.1
SW_CS_N_A: length 24
  Top Layer w0.38: U7.6 32.95,53.21 R31.1 34.43,53.12 R35.2 46.66,40.89 49.02,40.89 49.15,41.02
SW_CS_N_B: length 23.1
  Top Layer w0.38: U7.7 32.9,54.48 R31.2 35.52,54.63 R34.1 36.95,53.34 40.1,53.34 48.61,44.83 P3.12
SW_EN_N: length 33.3
  Top Layer w0.38: CN1.18 8.38,58.04 11.3,55.12 11.3,42.55 13.84,40.01 U6.1
SW_EN_N_A: length 23.8
  Top Layer w0.38: U6.6 32.84,37.47 R26.1 34.56,37.26 R30.2 46.16,25.65 49.02,25.65 P3.7
SW_EN_N_B: length 22.8
  Top Layer w0.38: 30.26,38.74 33.01,38.74 R26.2 35.52,38.77 R29.1 36.97,37.47 40.39,37.47 48.26,29.59 P3.8
SW_WR_N: length 41
  Top Layer w0.38: CN1.17 5.08,56.77 7.75,56.77 9.4,55.12 9.4,39.12 16.13,32.38 U8.1
SW_WR_N_A: length 23.7
  Top Layer w0.38: P3.5 46,18.16 R40.2 34.43,29.74 R36.1 32.93,29.84 30.26,29.84
SW_WR_N_B: length 22.9
  Top Layer w0.38: P3.6 49.02,21.84 47.88,21.84 39.75,29.97 36.94,29.97 R39.1 35.52,31.24 R36.2 32.91,31.12 U8.7
TAI_NI: length 88.6
  Bottom Layer w0.38: P1.8 12.45,123.32 9.91,120.78 9.91,76.33 9.4,75.82 CN1.4
TAO_NI: length 89.9
  Bottom Layer w0.38: 6.35,73.28 12.45,73.28 13.21,74.04 13.21,117.73 17.65,122.17 46.61,122.17 P1.7
TCLK_NI: length 55.6
  Top Layer w0.38: CN1.8 9.02,70.74 10.29,72.01 10.29,106.05 16.13,111.89 U9.1
TCLK_NI_A: length 24.1
  Top Layer w0.38: U9.6 33.07,109.35 R41.1 34.65,109.27 R45.2 47.28,96.65 P1.1
TCLK_NI_B: length 23.2
  Top Layer w0.38: U9.7 32.98,110.62 R41.2 35.79,110.78 R44.1 37.22,109.35 39.85,109.35 48.74,100.46 P1.2
TDI_NI: length 44.1
  Top Layer w0.38: U11.1 15.37,24.64 6.35,33.66 6.35,55.5
TDI_NI_A: length 23.7
  Top Layer w0.38: P3.3 45.97,10.54 R55.2 34.53,21.99 R51.1 32.9,22.1 U11.6
TDI_NI_B: length 22.8
  Top Layer w0.38: U11.7 32.89,23.37 R51.2 35.62,23.5 R54.1 37.03,22.22 39.5,22.22 47.37,14.35 P3.4
TDO_NI: length 41.7
  Top Layer w0.38: CN1.9 5.08,66.93 10.16,66.93 12.45,69.22 12.45,85.85 18.29,91.69 U13.4
TDO_NI_A: length 24.1
  Top Layer w0.38: U13.6 33.03,92.96 R61.1 34.8,92.85 47.38,80.26 P2.7
TDO_NI_B: length 23.2
  Top Layer w0.38: P2.8 48.74,84.07 39.85,92.96 37.35,92.96 R64.1 35.94,94.35 R61.2 33.03,94.23 U13.7
TSTROBE_NI: length 50.1
  Top Layer w0.38: 3.81,55.5 3.81,33.27 20.19,16.89 U10.1
TSTROBE_NI_A: length 23.6
  Top Layer w0.38: P3.1 45.87,2.92 R50.2 34.65,14.13 R46.1 32.79,14.35 U10.6
TSTROBE_NI_B: length 22.6
  Top Layer w0.38: P3.2 47.5,6.73 39.88,14.35 37.05,14.35 R49.1 35.62,15.64 R46.2 33,15.62 U10.7
$1N832: length 4
  Top Layer w0.38: U1.2 U1.3 24.96,77.06 R2.1
$1N23092: length 4
  Top Layer w0.38: U2.2 U2.3 24.94,85.17 R8.1
$1N23454: length 4
  Top Layer w0.38: U3.2 U3.3 24.79,61.15 22.16,61.15
$1N23823: length 4.2
  Top Layer w0.38: R18.1 U4.3 U4.2
$1N24177: length 4
  Top Layer w0.38: R23.1 U5.3 U5.2
$1N24547: length 4.1
  Top Layer w0.38: R28.1 24.83,37.44 U6.3 24.85,38.74
$1N24901: length 4.1
  Top Layer w0.38: R33.1 24.81,53.17 U7.3 U7.2
$1N25255: length 4.2
  Top Layer w0.38: R38.1 24.8,29.79 24.85,29.84 U8.2
$1N26283: length 4.1
  Top Layer w0.38: U9.2 U9.3 24.96,109.32 R43.1
$1N26304: length 3.9
  Top Layer w0.38: U10.2 U10.3 R48.1
$1N26325: length 3.9
  Top Layer w0.38: R53.1 24.79,22.04 U11.3 U11.2
$1N27345: length 3.8
  Top Layer w0.38: U12.2 U12.3 R58.1
$1N27366: length 3.9
  Top Layer w0.38: U13.3 U13.2 24.94,94.19 R63.1
$1N27387: length 3.9
  Top Layer w0.38: R68.1 24.79,118.69 U14.2 U14.3

## Copper pours and planes (outline as drawn; the poured copper is in the pictures)
GND on Bottom Layer: 0,134 58,134 58,0 0,0
SW_VDD on Top Layer: 0,134 58,134 58,0 0,0

## Text on the board
Top Silkscreen Layer: RSTN | GND | TDO | A0 | A2 | A4 | WR | TST | MCU_VDD | SW_VDD | TCLK | TAI | TAO | TDI | CS | EN | A1 | A3 | RSTN_A | TCLK_A | RSTN_B | TCLK_B | TST_A | TST_B | TDO_B | TDO_A | MCO_B | MCO_A | TDI_B | TDI_A | WR_A | EN_A | EN_B | WR_B | A0_A | A3_A | A4_B | A4_A | A1_B | A1_A | A0_B | A3_B | A2_B | A2_A | CS_B | CS_A | MCO | 澎湃微电子 | SOCKET_485_MCU_GERBER_2.0 | MCU端

# Board PCB2
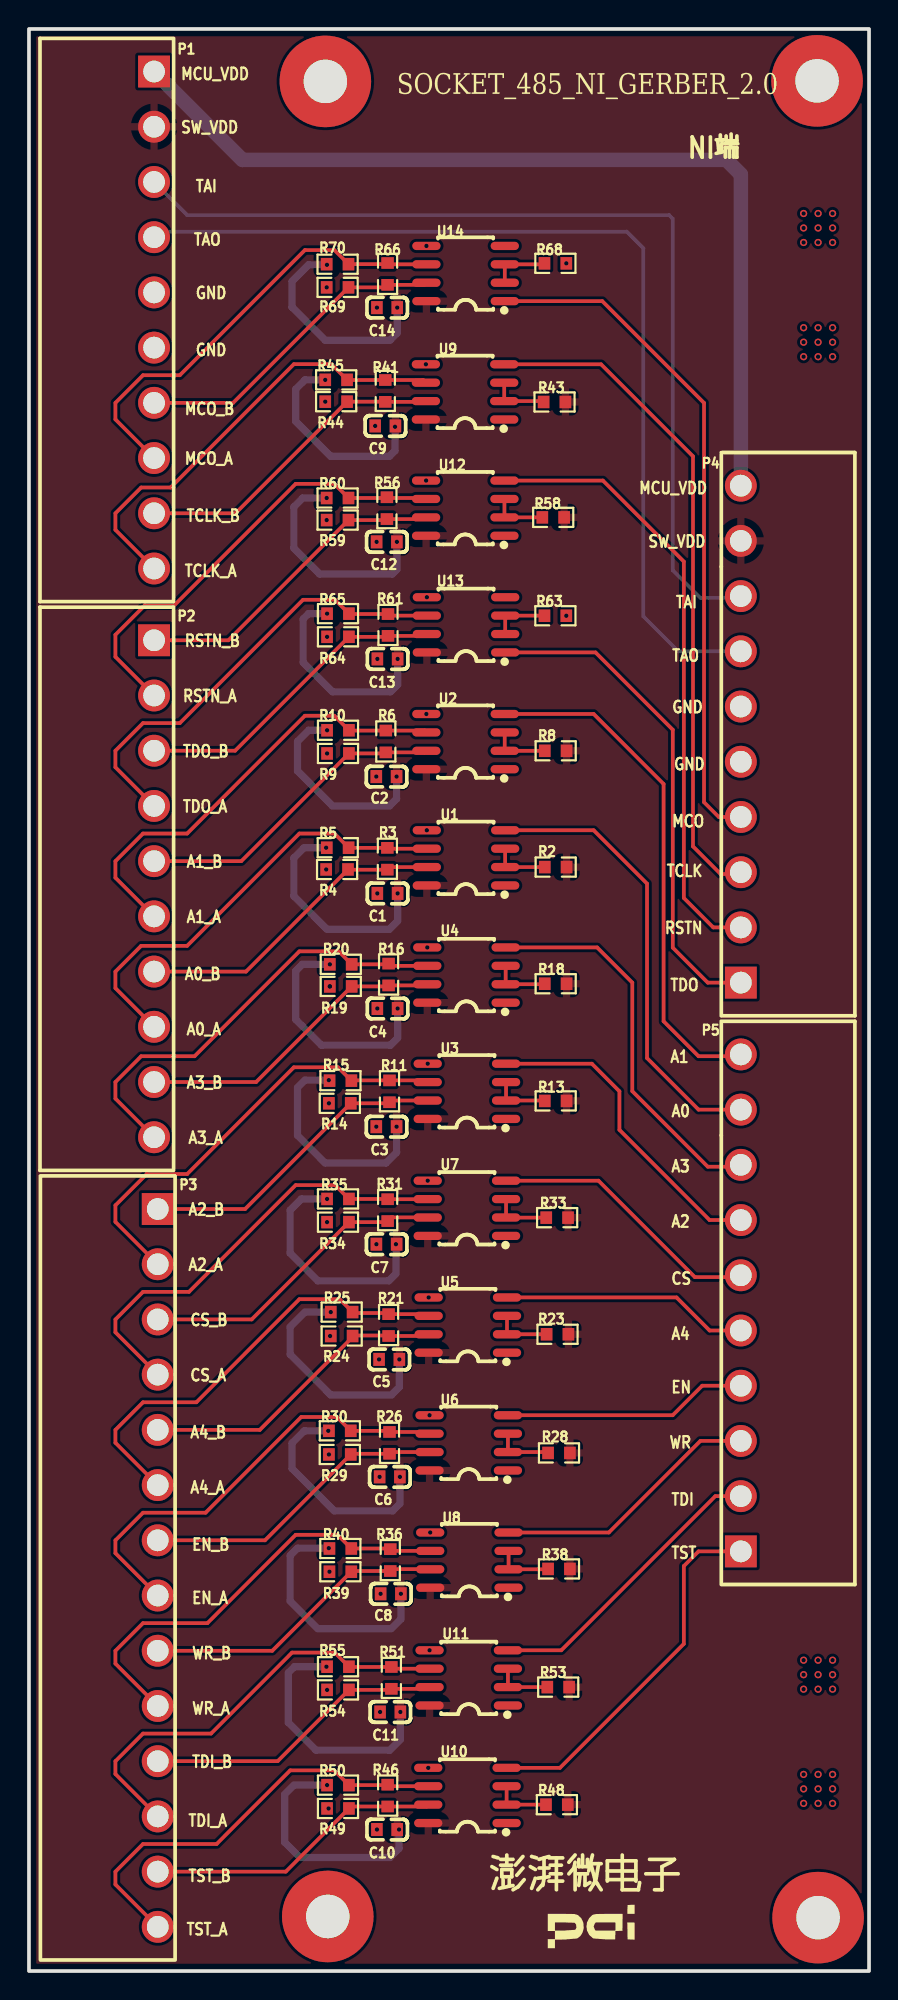
[diagram p4: board, top side]
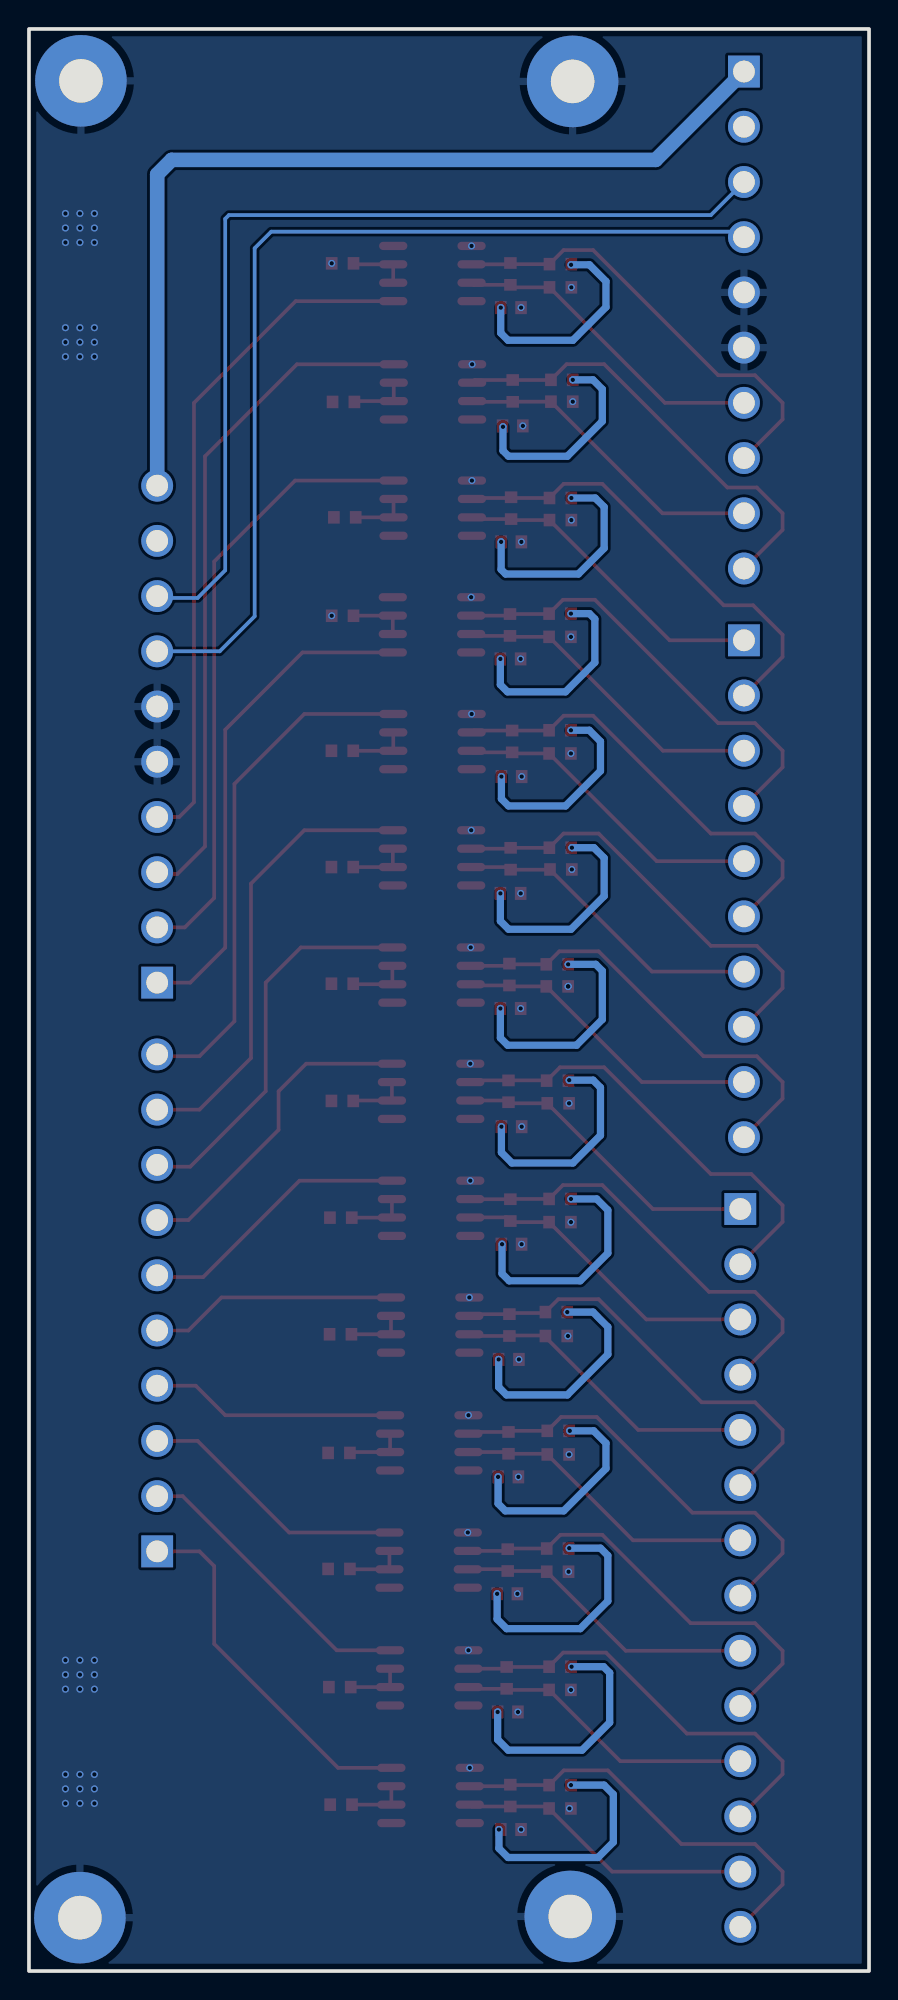
[diagram p5: board, bottom side, seen from below]

Outline 58 x 134 mm; copper layers: Top Layer, Bottom Layer. Coordinates in mm from the lower left corner of the outline.
Outline path: rectangle 0,134 58,0
Stack: Top Layer 0.035mm / Dielectric1 1.51mm FR4 er 4.5 / Bottom Layer 0.035mm

## Design rules (mm)
template: 自定义配置
spacing copperThickness1oz (default): track to track 0.102, other pairs 0.152 to 0.3
spacing copperThickness2oz: track to track 0.203, other pairs 0.152 to 0.3
track width copperThickness1oz (default): min 0.127, default 0.254, max 2.54
track width copperThickness2oz: min 0.203, default 0.254, max 2.54
differential pair differentialPair (default): width min 0.127, default 0.254, max 2.54; gap min 0.152, default 0.152
via viaSize (default): diameter min 0.5, default 0.61, max 10; hole min 0.3, default 0.305, max 6.3

## Placement (name value [footprint] x y rotation side)
C1  10uF  [C0603]  24.75 74.35 180 top
C2  10uF  [C0603]  24.68 82.42 180 top
C3  10uF  [C0603]  24.68 58.26 180 top
C4  10uF  [C0603]  24.75 66.41 180 top
C5  10uF  [C0603]  24.87 42.2 180 top
C6  10uF  [C0603]  24.91 34.1 180 top
C7  10uF  [C0603]  24.69 50.15 180 top
C8  10uF  [C0603]  24.98 26.03 180 top
C9  10uF  [C0603]  24.6 106.61 180 top
C10  10uF  [C0603]  24.72 9.76 180 top
C11  10uF  [C0603]  24.94 17.87 180 top
C12  10uF  [C0603]  24.7 98.61 180 top
C13  10uF  [C0603]  24.75 90.53 180 top
C14  10uF  [C0603]  24.72 114.77 180 top
J1  -  [demo板安装孔]  20.63 3.76 0 top
J2  -  [demo板安装孔]  20.47 130.38 0 top
J3  -  [demo板安装孔]  54.41 130.42 0 top
J4  -  [demo板安装孔]  54.48 3.68 0 top
P1  WJ15EDGRC-3.81-10P  [CONN-TH_10P-P3.81_WJ15EDGRC-3.81-10P]  8.64 113.92 270 top
P2  WJ15EDGRC-3.81-10P  [CONN-TH_10P-P3.81_WJ15EDGRC-3.81-10P]  8.64 74.68 270 top
P3  WJ15EDGRC-3.81-14P  [CONN-TH_14P-P3.81_WJ15EDGRC-3.81-14P]  8.89 27.81 270 top
P4  WJ15EDGRC-3.81-10P  [CONN-TH_10P-P3.81_WJ15EDGRC-3.81-10P]  49.15 85.34 90 top
P5  WJ15EDGRC-3.81-10P  [CONN-TH_10P-P3.81_WJ15EDGRC-3.81-10P]  49.15 46.1 90 top
R2  4.7kΩ  [R0603]  36.37 76.17 0 top
R3  120Ω  [R0603]  24.75 76.75 270 top
R4  4.7kΩ  [R0603]  21.27 76.01 180 top
R5  4.7kΩ  [R0603]  21.32 77.51 0 top
R6  120Ω  [R0603]  24.64 84.84 270 top
R8  4.7kΩ  [R0603]  36.37 84.19 0 top
R9  4.7kΩ  [R0603]  21.34 84.01 180 top
R10  4.7kΩ  [R0603]  21.34 85.61 0 top
R11  120Ω  [R0603]  24.89 60.7 270 top
R13  4.7kΩ  [R0603]  36.37 60.04 0 top
R14  4.7kΩ  [R0603]  21.46 59.87 180 top
R15  4.7kΩ  [R0603]  21.51 61.43 0 top
R16  120Ω  [R0603]  24.83 68.76 270 top
R18  4.7kΩ  [R0603]  36.37 68.12 0 top
R19  4.7kΩ  [R0603]  21.53 67.94 180 top
R20  4.7kΩ  [R0603]  21.53 69.46 0 top
R21  120Ω  [R0603]  24.83 44.57 270 top
R23  4.7kΩ  [R0603]  36.49 43.94 0 top
R24  4.7kΩ  [R0603]  21.59 43.81 180 top
R25  4.7kΩ  [R0603]  21.59 45.47 0 top
R26  120Ω  [R0603]  24.89 36.44 270 top
R28  4.7kΩ  [R0603]  36.59 35.75 0 top
R29  4.7kΩ  [R0603]  21.46 35.64 180 top
R30  4.7kΩ  [R0603]  21.46 37.27 0 top
R31  120Ω  [R0603]  24.77 52.5 270 top
R33  4.7kΩ  [R0603]  36.47 51.98 0 top
R34  4.7kΩ  [R0603]  21.34 51.67 180 top
R35  4.7kΩ  [R0603]  21.34 53.27 0 top
R36  120Ω  [R0603]  24.95 28.35 270 top
R38  4.7kΩ  [R0603]  36.59 27.75 0 top
R39  4.7kΩ  [R0603]  21.5 27.55 180 top
R40  4.7kΩ  [R0603]  21.5 29.15 0 top
R41  120Ω  [R0603]  24.6 109.03 270 top
R43  4.7kΩ  [R0603]  36.29 108.26 0 top
R44  4.7kΩ  [R0603]  21.21 108.29 180 top
R45  4.7kΩ  [R0603]  21.21 109.79 0 top
R46  120Ω  [R0603]  24.77 12.1 270 top
R48  4.7kΩ  [R0603]  36.45 11.48 0 top
R49  4.7kΩ  [R0603]  21.34 11.22 180 top
R50  4.7kΩ  [R0603]  21.34 12.83 0 top
R51  120Ω  [R0603]  25.02 20.22 270 top
R53  4.7kΩ  [R0603]  36.54 19.59 0 top
R54  4.7kΩ  [R0603]  21.34 19.4 180 top
R55  4.7kΩ  [R0603]  21.34 21 0 top
R56  120Ω  [R0603]  24.71 100.94 270 top
R58  4.7kΩ  [R0603]  36.19 100.3 0 top
R59  4.7kΩ  [R0603]  21.31 100.11 180 top
R60  4.7kΩ  [R0603]  21.31 101.64 0 top
R61  120Ω  [R0603]  24.79 92.88 270 top
R63  4.7kΩ  [R0603]  36.34 93.51 0 top
R64  4.7kΩ  [R0603]  21.34 92.06 180 top
R65  4.7kΩ  [R0603]  21.34 93.66 0 top
R66  120Ω  [R0603]  24.76 117.1 270 top
R68  4.7kΩ  [R0603]  36.34 117.83 0 top
R69  4.7kΩ  [R0603]  21.31 116.17 180 top
R70  4.7kΩ  [R0603]  21.31 117.77 0 top
U1  SP485EEN-L/TR  [SOIC-8_L5.0-W4.0-P1.27-LS6.0-BL]  30.17 76.81 90 top
U2  SP485EEN-L/TR  [SOIC-8_L5.0-W4.0-P1.27-LS6.0-BL]  30.14 84.83 90 top
U3  SP485EEN-L/TR  [SOIC-8_L5.0-W4.0-P1.27-LS6.0-BL]  30.24 60.7 90 top
U4  SP485EEN-L/TR  [SOIC-8_L5.0-W4.0-P1.27-LS6.0-BL]  30.21 68.72 90 top
U5  SP485EEN-L/TR  [SOIC-8_L5.0-W4.0-P1.27-LS6.0-BL]  30.3 44.57 90 top
U6  SP485EEN-L/TR  [SOIC-8_L5.0-W4.0-P1.27-LS6.0-BL]  30.36 36.44 90 top
U7  SP485EEN-L/TR  [SOIC-8_L5.0-W4.0-P1.27-LS6.0-BL]  30.24 52.63 90 top
U8  SP485EEN-L/TR  [SOIC-8_L5.0-W4.0-P1.27-LS6.0-BL]  30.41 28.35 90 top
U9  SP485EEN-L/TR  [SOIC-8_L5.0-W4.0-P1.27-LS6.0-BL]  30.11 108.96 90 top
U10  SP485EEN-L/TR  [SOIC-8_L5.0-W4.0-P1.27-LS6.0-BL]  30.27 12.11 90 top
U11  SP485EEN-L/TR  [SOIC-8_L5.0-W4.0-P1.27-LS6.0-BL]  30.36 20.22 90 top
U12  SP485EEN-L/TR  [SOIC-8_L5.0-W4.0-P1.27-LS6.0-BL]  30.12 100.94 90 top
U13  SP485EEN-L/TR  [SOIC-8_L5.0-W4.0-P1.27-LS6.0-BL]  30.18 92.89 90 top
U14  SP485EEN-L/TR  [SOIC-8_L5.0-W4.0-P1.27-LS6.0-BL]  30.15 117.13 90 top

## Footprints (pads in the part's own frame, mm; a bottom-side part is the same pattern mirrored in y, then rotated)
C0603
  rect 0.8x0.9 smd: 1(-0.7,0) 2(0.7,0)
CONN-TH_10P-P3.81_WJ15EDGRC-3.81-10P
  rect 2.2x2.2 hole 1.5: 1(-17.145,0)
  round 2.2 hole 1.5: 2(-13.335,0) 3(-9.525,0) 4(-5.715,0) 5(-1.905,0) 6(1.905,0) 7(5.715,0) 8(9.525,0) 9(13.335,0) 10(17.145,0)
CONN-TH_14P-P3.81_WJ15EDGRC-3.81-14P
  rect 2.2x2.2 hole 1.5: 1(-24.765,0)
  round 2.2 hole 1.5: 2(-20.955,0) 3(-17.145,0) 4(-13.335,0) 5(-9.525,0) 6(-5.715,0) 7(-1.905,0) 8(1.905,0) 9(5.715,0) 10(9.525,0) 11(13.335,0) 12(17.145,0) 13(20.955,0) 14(24.765,0)
demo板安装孔
  round 6.32 hole 3: 1(0,0)
R0603
  rect 0.806x0.864 smd: 1(-0.753,0) 2(0.753,0)
SOIC-8_L5.0-W4.0-P1.27-LS6.0-BL
  oval 0.569x1.95 smd: 1(-1.905,-2.705) 2(-0.635,-2.705) 3(0.635,-2.705) 4(1.905,-2.705) 5(1.905,2.705) 6(0.635,2.705) 7(-0.635,2.705) 8(-1.905,2.705)

## Nets
As in the schematic.

Pads without a net: U1 1; U2 1; U3 1; U4 1; U5 1; U6 1; U7 1; U8 1; U9 1; U10 1; U11 1; U12 1; U13 4; U14 4

## Via types
v1: diameter 0.5, hole 0.305, Top Layer to Bottom Layer, 109 vias

## Routing (per net, layer and track width the routed paths; a pad name or vN(x,y) marks a point on that pad's centre or on a via; arc(x,y) is an arc through that point)
GND:
  vias: v1(20.46,108.29) v1(20.55,116.17) v1(20.55,100.11) v1(20.52,76.01) v1(20.58,92.06) v1(20.58,84.01) v1(20.58,51.67) v1(20.58,19.4) v1(20.71,59.87) v1(20.71,35.64) v1(20.75,27.55) v1(20.69,11.22) v1(20.77,67.94) v1(20.77,67.94) v1(20.79,43.81) v1(23.9,106.61) v1(24.03,114.77) v1(24,98.61) v1(24.05,90.53) v1(23.98,82.42) v1(24.05,74.35) v1(24.05,66.41) v1(23.98,58.26) v1(23.99,50.15) v1(24.02,9.76) v1(24.17,42.2) v1(24.21,34.1) v1(24.24,17.87) v1(24.28,26.03) v1(27.44,119.03) v1(27.4,110.86) v1(27.42,102.84) v1(27.44,86.73) v1(27.47,94.79) v1(27.47,78.71) v1(27.5,70.63) v1(27.53,62.6) v1(27.53,54.53) v1(27.59,46.48) v1(27.66,38.35) v1(27.66,22.13) v1(27.57,14.02) v1(27.7,30.26) v1(37.1,117.83) v1(37.1,93.51) v1(53.48,121.27) v1(53.48,120.27) v1(53.48,119.27) v1(53.48,113.39) v1(53.48,112.39) v1(53.48,111.39) v1(53.48,21.45) v1(53.48,20.45) v1(53.48,19.45) v1(53.48,13.57) v1(53.48,12.57) v1(53.48,11.57) v1(54.48,121.27) v1(54.48,120.27) v1(54.48,119.27) v1(54.48,113.39) v1(54.48,112.39) v1(54.48,111.39) v1(54.48,21.45) v1(54.48,20.45) v1(54.48,19.45) v1(54.48,13.57) v1(54.48,12.57) v1(54.48,11.57) v1(55.48,121.27) v1(55.48,120.27) v1(55.48,119.27) v1(55.48,113.39) v1(55.48,112.39) v1(55.48,111.39) v1(55.48,21.45) v1(55.48,20.45) v1(55.48,19.45) v1(55.48,13.57) v1(55.48,12.57) v1(55.48,11.57)
MCO_NI: length 47.2
  Top Layer w0.254: P4.4 47.62,79.63 46.61,80.64 46.61,108.19 39.58,115.22 U14.1
MCO_NI_A: length 31.2
  Top Layer w0.254: U14.6 24.85,117.76 R66.1 24.68,117.77 R70.2 21.09,118.74 19.05,118.74 10.41,110.11 7.87,110.11 5.97,108.2 5.97,107.06 P1.8
MCO_NI_B: length 22.2
  Top Layer w0.254: U14.7 27.3,116.35 R66.2 24.59,116.17 R69.1 14.09,108.2 P1.7
MCU_VDD: length 64.9
  Bottom Layer w1: P4.10 49.15,123.97 48.15,124.97 14.73,124.97 P1.1
RSTN_NI: length 42.7
  Top Layer w0.254: U12.4 39.62,102.84 45.21,97.25 45.21,74.04 47.24,72.01 P4.2
RSTN_NI_A: length 31.6
  Top Layer w0.254: 24.66,101.64 R60.2 21.08,102.62 18.41,102.62 10.03,94.23 8,94.23 5.97,92.2 5.97,90.68 P2.2 ; 24.66,101.64 R56.1 ; 24.66,101.64 27.35,101.64 U12.6
RSTN_NI_B: length 22.3
  Top Layer w0.254: U12.7 27.3,100.18 R56.2 24.64,100.11 R59.1 13.77,91.82 P2.1
SW_A0: length 31.3
  Top Layer w0.254: P5.9 46.23,59.44 42.67,62.99 42.67,75.03 38.99,78.71 U1.4
SW_A0_A: length 30.8
  Top Layer w0.254: 8.64,65.15 5.97,67.82 5.97,68.96 7.75,70.74 10.92,70.74 18.67,78.49 21.09,78.49 R5.2 22.08,77.5 R3.1 24.8,77.44 U1.6
SW_A0_B: length 21.8
  Top Layer w0.254: U1.7 24.92,76.17 R3.2 22.04,75.99 22.03,76.01 14.98,68.96 P2.7
SW_A1: length 35.7
  Top Layer w0.254: U2.4 38.99,86.73 43.81,81.91 43.81,65.53 46.23,63.12 49.02,63.12 P5.10
SW_A1_A: length 31
  Top Layer w0.254: U2.6 27.31,85.59 R6.1 22.11,85.59 R10.2 21.09,86.61 19.05,86.61 10.92,78.49 7.87,78.49 5.97,76.58 5.97,75.44 P2.6
SW_A1_B: length 22
  Top Layer w0.254: U2.7 27.33,84.09 R6.2 24.56,84.01 R9.1 14.66,76.58 P2.5
SW_A2: length 22.2
  Top Layer w0.254: U3.4 38.86,62.6 40.77,60.7 40.77,58.04 46.99,51.82 P5.7
SW_A2_A: length 31.2
  Top Layer w0.254: P3.2 5.97,51.69 5.97,52.83 8.13,54.99 10.92,54.99 18.29,62.36 21.34,62.36 R15.2 22.28,61.45 R11.1 27.41,61.45 U3.6
SW_A2_B: length 21.7
  Top Layer w0.254: P3.1 14.92,52.58 R14.1 24.82,59.87 R11.2 25.01,60.06 U3.7
SW_A3: length 26.9
  Top Layer w0.254: P5.8 49.02,55.5 46.86,55.5 41.66,60.71 41.66,68.2 39.23,70.63 U4.4
SW_A3_A: length 30.6
  Top Layer w0.254: P2.10 5.97,60.2 5.97,61.34 7.75,63.12 11.43,63.12 18.67,70.36 21.38,70.36 R20.2 24.78,69.46 24.83,69.51 24.98,69.36 U4.6
SW_A3_B: length 21.7
  Top Layer w0.254: P2.9 15.68,61.34 R19.1 24.76,67.94 R16.2 27.42,68 U4.7
SW_A4: length 17.1
  Top Layer w0.254: 33,46.48 44.71,46.48 46.99,44.2 P5.5
SW_A4_A: length 30.9
  Top Layer w0.254: U5.6 27.48,45.32 R21.1 24.75,45.4 22.41,45.4 21.45,46.35 18.67,46.35 11.56,39.24 7.87,39.24 5.97,37.34 5.97,36.45 P3.6
SW_A4_B: length 21.5
  Top Layer w0.254: U5.7 27.48,43.82 R21.2 24.8,43.85 22.45,43.85 15.94,37.34 P3.5
SW_CS_N: length 19
  Top Layer w0.254: U7.4 39.32,54.53 45.97,47.88 49.02,47.88 P5.6
SW_CS_N_A: length 30.8
  Top Layer w0.254: P3.4 5.97,44.07 5.97,44.96 7.87,46.86 11.05,46.86 18.41,54.23 21.13,54.23 R35.2 24.75,53.27 R31.1 27.52,53.25 U7.6
SW_CS_N_B: length 21.6
  Top Layer w0.254: U7.7 27.52,52 25.02,52 R31.2 24.69,51.67 R34.1 15.37,44.96 P3.3
SW_EN_N: length 16.9
  Top Layer w0.254: P5.4 46.48,40.39 44.44,38.35 U6.4
SW_EN_N_A: length 30.7
  Top Layer w0.254: P3.8 5.97,28.83 5.97,29.72 7.87,31.62 12.19,31.62 18.8,38.23 21.26,38.23 R30.2 24.81,37.27 R26.1 27.54,37.2 U6.6
SW_EN_N_B: length 21.3
  Top Layer w0.254: U6.7 25.01,35.81 R26.2 22.26,35.69 R29.1 16.29,29.72 P3.7
SW_VDD: length 216.5
  Top Layer w0.254: R70.1 20.55,117.75 v1(20.57,117.73) ; v1(25.27,106.55) 25.27,106.58 C9.1
  Bottom Layer w0.5: v1(25.43,114.77) 25.43,113.02 24.93,112.52 20.45,112.52 18.16,114.81 18.16,116.59 19.3,117.73 v1(20.57,117.73) ; v1(25.45,66.41) 25.45,64.38 24.95,63.88 20.19,63.88 18.41,65.66 18.41,69.01 18.87,69.46 v1(20.77,69.46) ; v1(20.7,29.18) 18.54,29.18 18.03,28.67 18.03,25.53 19.94,23.62 25.02,23.62 25.68,24.28 v1(25.68,26.03) ; v1(25.64,17.87) 25.64,15.97 24.91,15.24 19.81,15.24 17.91,17.14 17.91,20.57 18.33,21 v1(20.54,21) ; v1(20.52,77.51) 18.99,77.51 18.29,76.8 18.29,74.17 20.57,71.88 24.88,71.88 25.45,72.45 v1(25.45,74.35) ; v1(25.55,9.76) 25.55,8.46 24.92,7.83 18.71,7.83 17.65,8.89 17.65,12.18 18.3,12.83 v1(20.58,12.83) ; v1(25.45,90.53) 25.45,88.76 24.96,88.26 20.96,88.26 18.93,90.29 18.93,93.29 19.3,93.66 v1(20.58,93.66) ; v1(25.27,106.55) 25.27,104.9 24.89,104.52 20.83,104.52 18.41,106.93 18.41,109.15 19.06,109.79 v1(20.46,109.79) ; v1(25.38,58.26) 25.38,56.48 24.65,55.75 20.45,55.75 18.54,57.66 18.54,60.96 19.05,61.47 v1(20.7,61.47) ; v1(25.61,34.1) 25.61,32.25 25.11,31.75 21.08,31.75 18.16,34.67 18.16,36.42 19.01,37.27 v1(20.66,37.27) ; v1(20.58,53.27) 18.8,53.27 18.03,52.5 18.03,49.53 19.94,47.62 24.85,47.62 25.34,48.12 v1(25.34,50.15) ; v1(25.57,42.2) 25.57,40.29 25.03,39.75 20.83,39.75 18.03,42.54 18.03,44.44 19.06,45.47 v1(20.84,45.47) ; v1(20.58,85.61) 19.31,85.61 18.54,84.84 18.54,82.8 20.96,80.39 24.89,80.39 25.38,80.88 v1(25.38,82.42) ; v1(20.55,101.64) 18.9,101.64 18.29,101.02 18.29,98.17 20.07,96.39 25.09,96.39 25.4,96.71 v1(25.4,98.61)
SW_WR_N: length 18.7
  Top Layer w0.254: U8.4 40.04,30.26 46.35,36.58 P5.3
SW_WR_N_A: length 30.5
  Top Layer w0.254: P3.10 5.97,21.21 5.97,22.1 7.87,24 12.32,24 18.41,30.1 21.31,30.1 R40.2 24.9,29.15 R36.1 25.06,28.99 U8.6
SW_WR_N_B: length 21.1
  Top Layer w0.254: U8.7 27.69,27.73 25.07,27.73 R36.2 22.3,27.6 R39.1 16.8,22.1 P3.9
TAI_NI: length 66.7
  Bottom Layer w0.254: P4.8 49.02,94.74 46.35,94.74 44.45,96.65 44.45,120.9 44.2,121.16 10.92,121.16 P1.3
TAO_NI: length 67.5
  Bottom Layer w0.254: P1.4 9.02,120.01 41.28,120.01 42.42,118.87 42.42,93.47 44.83,91.06 P4.7
TCLK_NI: length 46.7
  Top Layer w0.254: P4.3 49.02,75.69 47.75,75.69 45.85,77.6 45.85,104.51 39.5,110.86 U9.4
TCLK_NI_A: length 31.1
  Top Layer w0.254: U9.6 27.22,109.78 R41.1 21.97,109.78 R45.2 20.88,110.87 18.29,110.87 9.78,102.36 7.75,102.36 5.97,100.58 5.97,99.44 P1.10
TCLK_NI_B: length 22
  Top Layer w0.254: U9.7 27.35,108.27 R41.2 24.59,108.29 R44.1 14.26,100.58 P1.9
TDI_NI: length 20.5
  Top Layer w0.254: U11.4 36.75,22.13 47.39,32.77 P5.2
TDI_NI_A: length 30.3
  Top Layer w0.254: P3.12 5.97,13.59 5.97,14.48 7.87,16.38 12.57,16.38 18.16,21.97 21.12,21.97 R55.2 22.11,20.98 R51.1 25.14,20.86 U11.6
TDI_NI_B: length 20.9
  Top Layer w0.254: P3.11 17.17,14.48 R54.1 24.95,19.4 R51.2 27.54,19.47 U11.7
TDO_NI: length 34.5
  Top Layer w0.254: P4.1 46.86,68.2 44.45,70.61 44.45,85.65 39.12,90.98 U13.1
TDO_NI_A: length 31.2
  Top Layer w0.254: U13.6 24.9,93.52 R61.1 22.12,93.63 R65.2 21.13,94.61 18.92,94.61 10.41,86.11 7.87,86.11 5.97,84.2 5.97,83.06 P2.4
TDO_NI_B: length 22.2
  Top Layer w0.254: P2.3 14.23,84.2 R64.1 24.72,92.06 R61.2 27.34,92.12 U13.7
TSTROBE_NI: length 25.5
  Top Layer w0.254: U10.4 36.66,14.02 45.21,22.57 45.21,27.94 46.23,28.96 P5.1
TSTROBE_NI_A: length 30
  Top Layer w0.254: U10.6 24.87,12.75 R46.1 24.73,12.83 R50.2 21.07,13.84 18.03,13.84 12.95,8.76 7.87,8.76 5.97,6.86 5.97,5.97 P3.14
TSTROBE_NI_B: length 20.6
  Top Layer w0.254: U10.7 27.44,11.35 R46.2 22.23,11.35 R49.1 17.73,6.86 P3.13
$1N33003: length 4
  Top Layer w0.254: R2.1 U1.2 U1.3
$1N33046: length 4
  Top Layer w0.254: U2.3 U2.2 R8.1
$1N33127: length 4
  Top Layer w0.254: U3.3 U3.2 35.59,60.06 R13.1
$1N33159: length 4
  Top Layer w0.254: R18.1 35.58,68.09 U4.2 U4.3
$1N33197: length 4
  Top Layer w0.254: R23.1 33,43.94 33,45.21
$1N33551: length 4.1
  Top Layer w0.254: U6.3 U6.2 35.78,35.81 R28.1
$1N33913: length 4
  Top Layer w0.254: R33.1 32.95,51.98 U7.2 U7.3
$1N34275: length 4
  Top Layer w0.254: R38.1 35.81,27.72 U8.2 U8.3
$1N34989: length 4
  Top Layer w0.254: U9.3 U9.2 35.47,108.32 R43.1
$1N35351: length 4
  Top Layer w0.254: R48.1 U10.2 U10.3
$1N35713: length 4
  Top Layer w0.254: R53.1 U11.2 U11.3
$1N36075: length 3.9
  Top Layer w0.254: U12.3 U12.2 R58.1
$1N36432: length 4
  Top Layer w0.254: R63.1 35.58,93.52 U13.3 U13.2
$1N36797: length 4
  Top Layer w0.254: R68.1 35.52,117.76 U14.3 U14.2

## Copper pours and planes (outline as drawn; the poured copper is in the pictures)
GND on Bottom Layer: 0,134 58,134 58,0 0,0
SW_VDD on Top Layer: 0,134 58,134 58,0 0,0

## Text on the board
Top Silkscreen Layer: MCU_VDD | SW_VDD | RSTN_A | TDO_B | TDO_A | MCO_B | MCO_A | TCLK_A | RSTN_B | A0_B | TCLK_B | A1_B | A1_A | A0_A | A3_B | TST_A | A3_A | A2_B | A2_A | TDI_A | TST_B | CS_B | CS_A | A4_B | A4_A | EN_B | EN_A | WR_B | WR_A | TDI_B | TAO | TAI | GND | RSTN | TCLK | WR | TDO | A1 | A3 | A2 | CS | A4 | EN | TDI | TST | A0 | MCO | 澎湃微电子 | SOCKET_485_NI_GERBER_2.0 | NI端
